# EAGLE board KickerBoard (EAGLE 9.2.0)
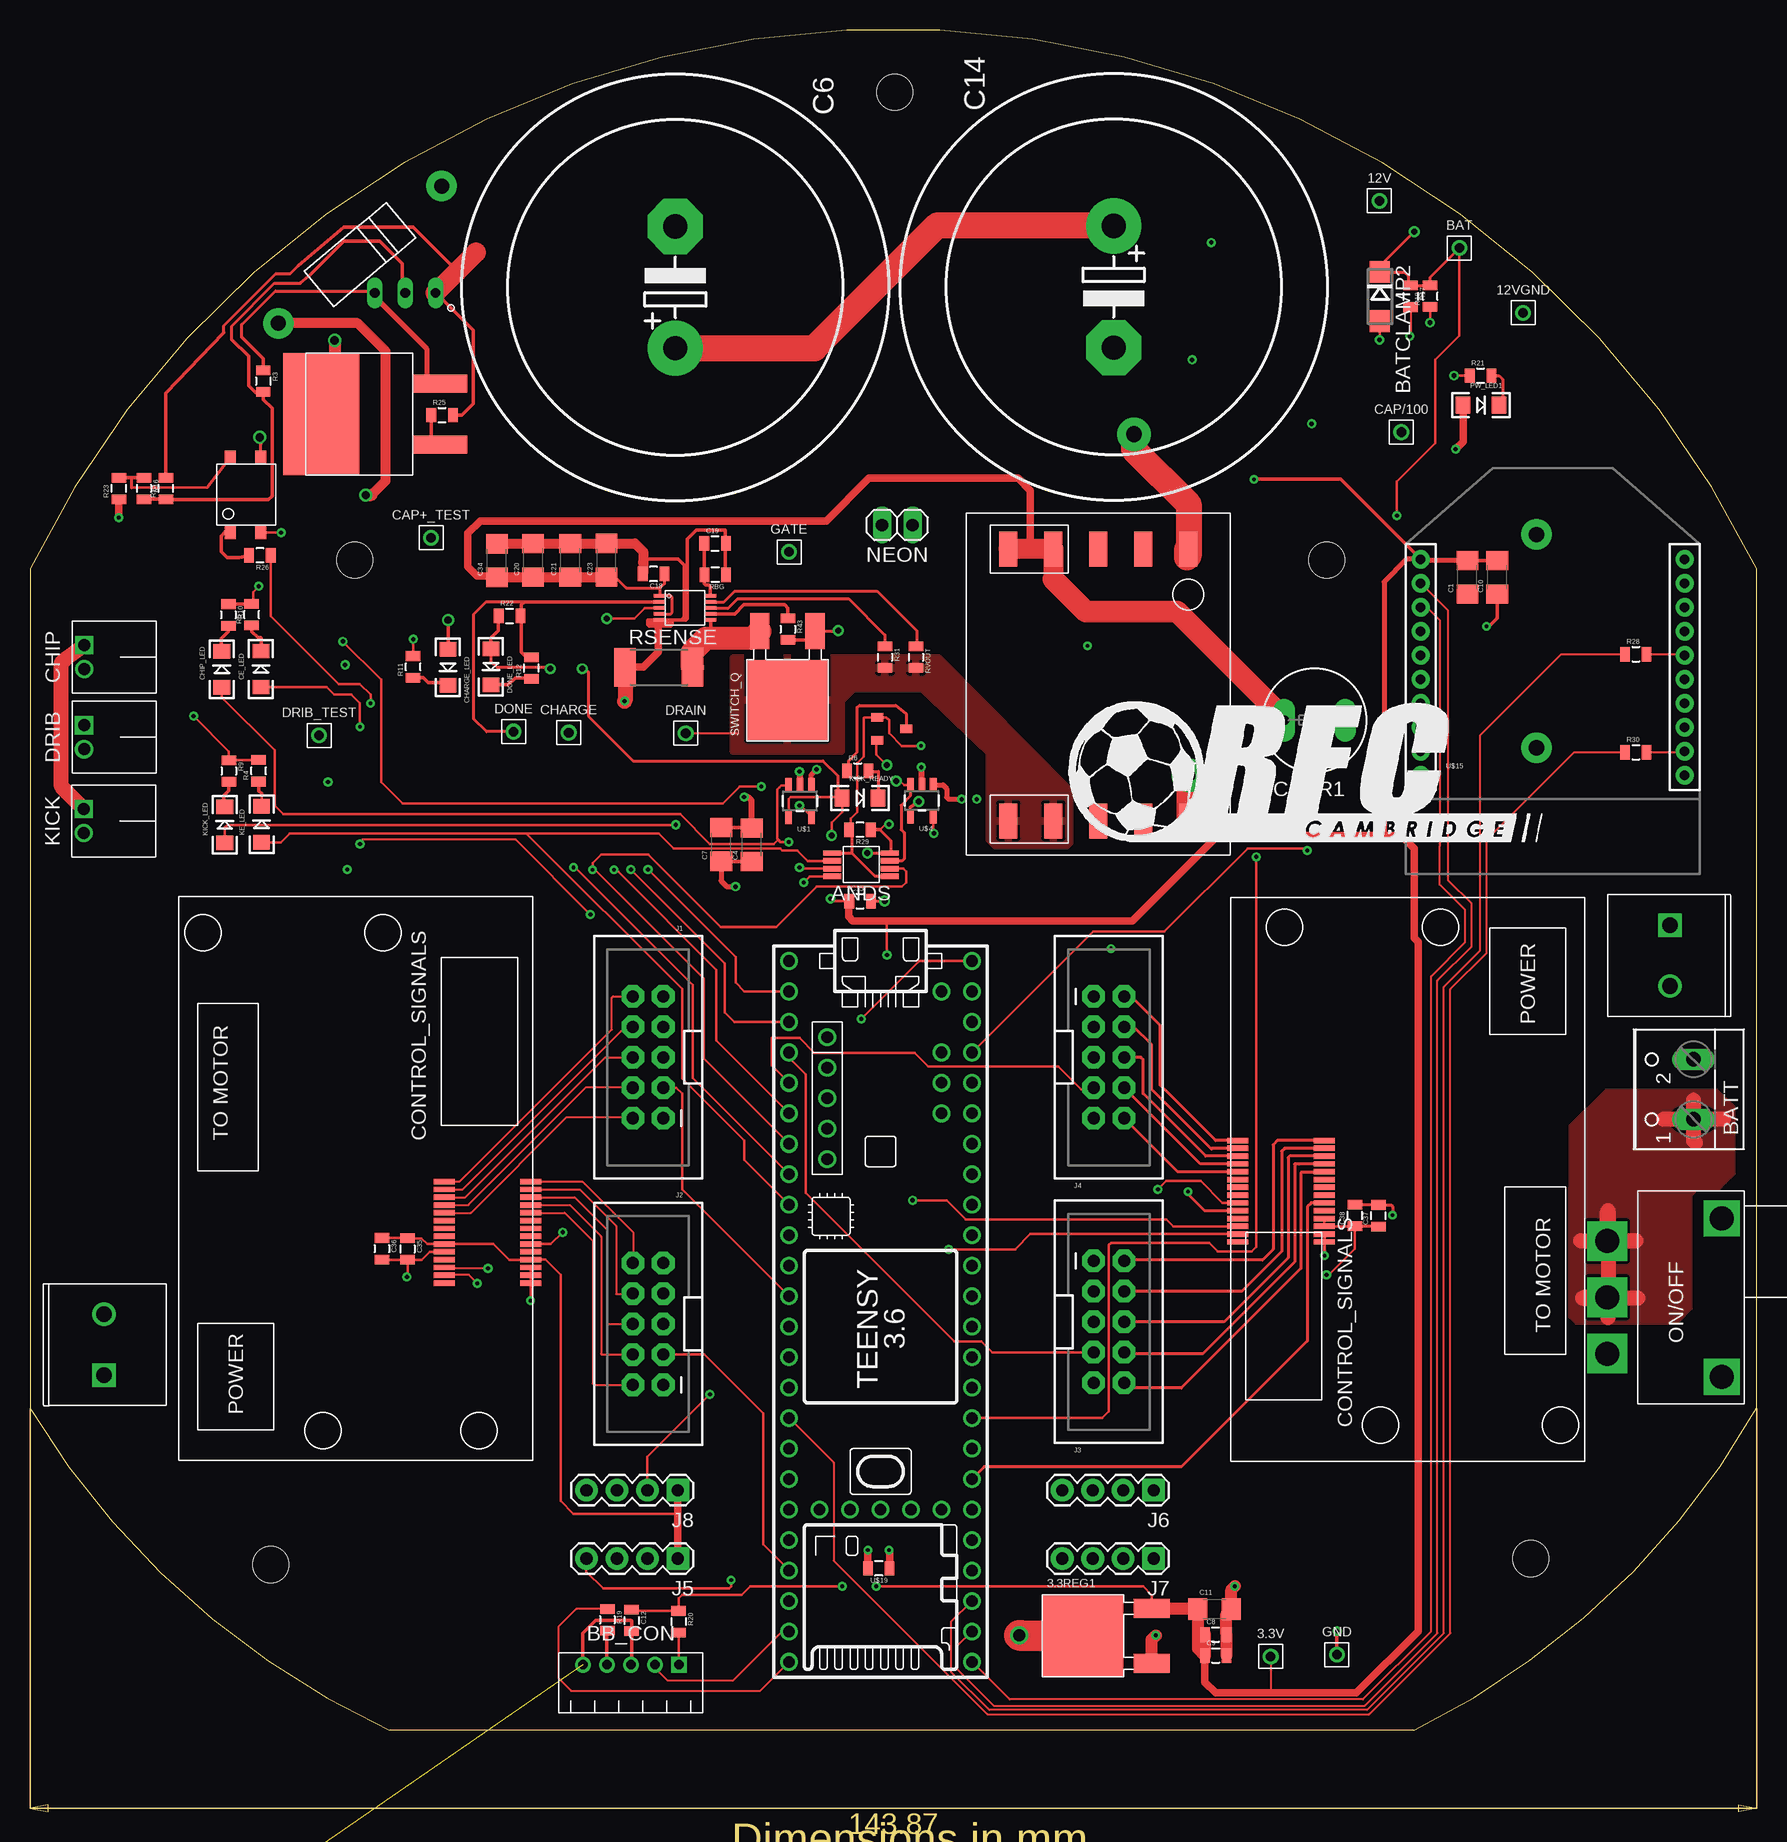
[diagram p2: board, top side]
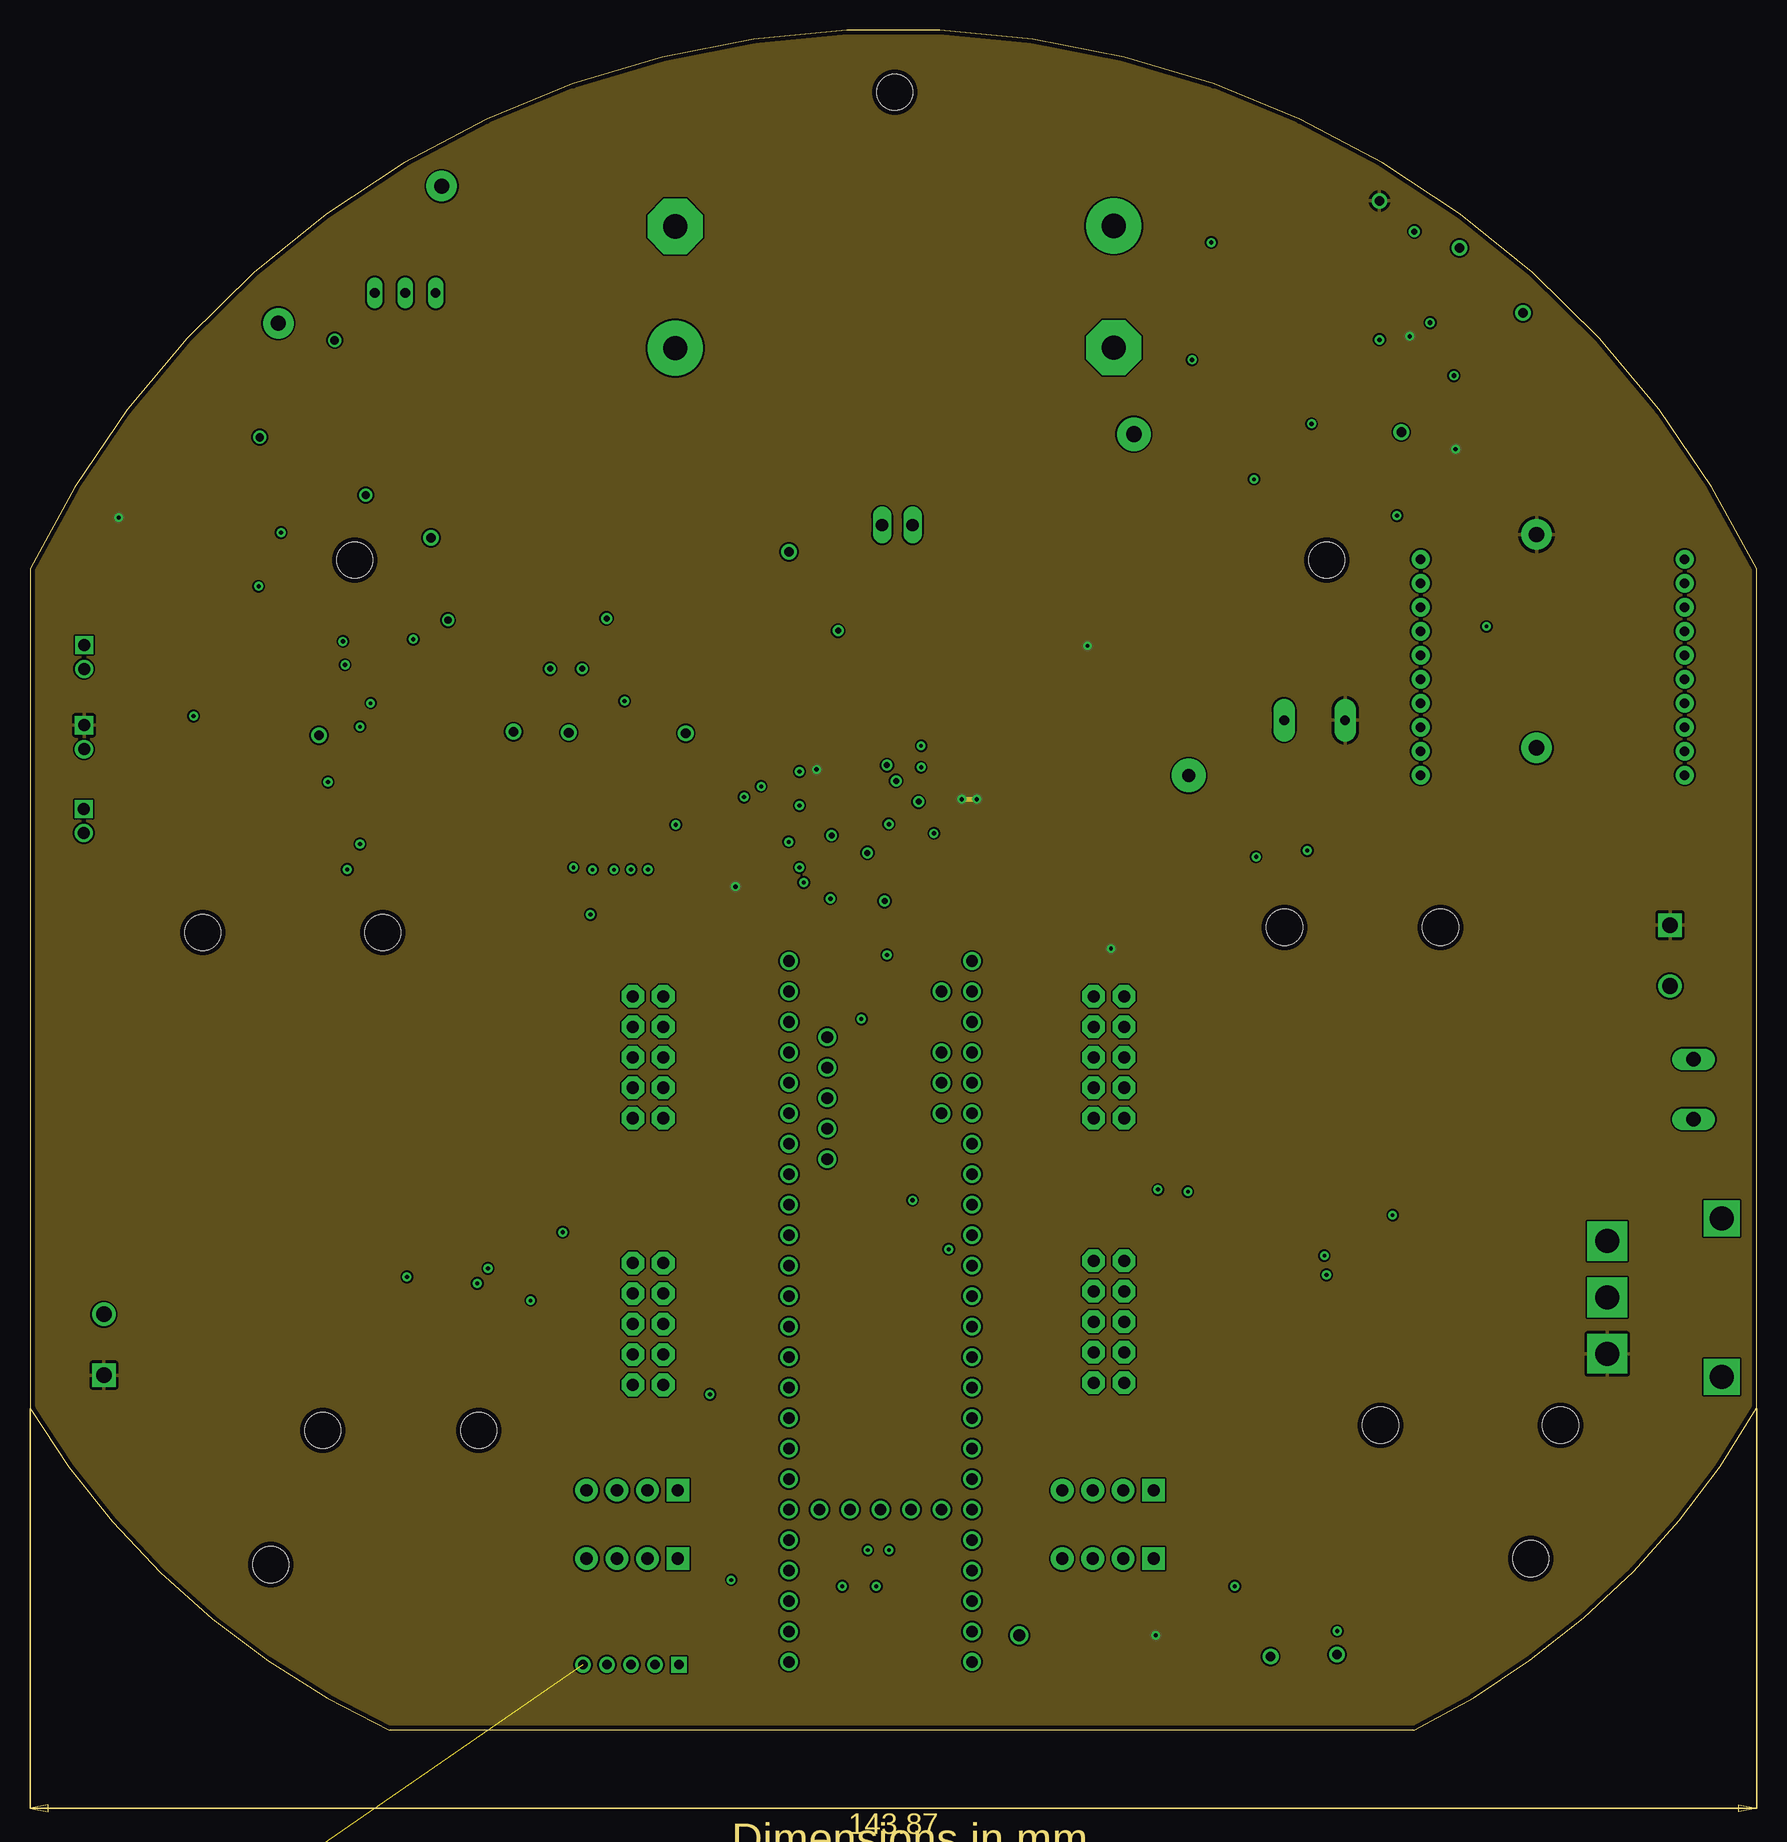
[diagram p3: board, inner layer 12V+]
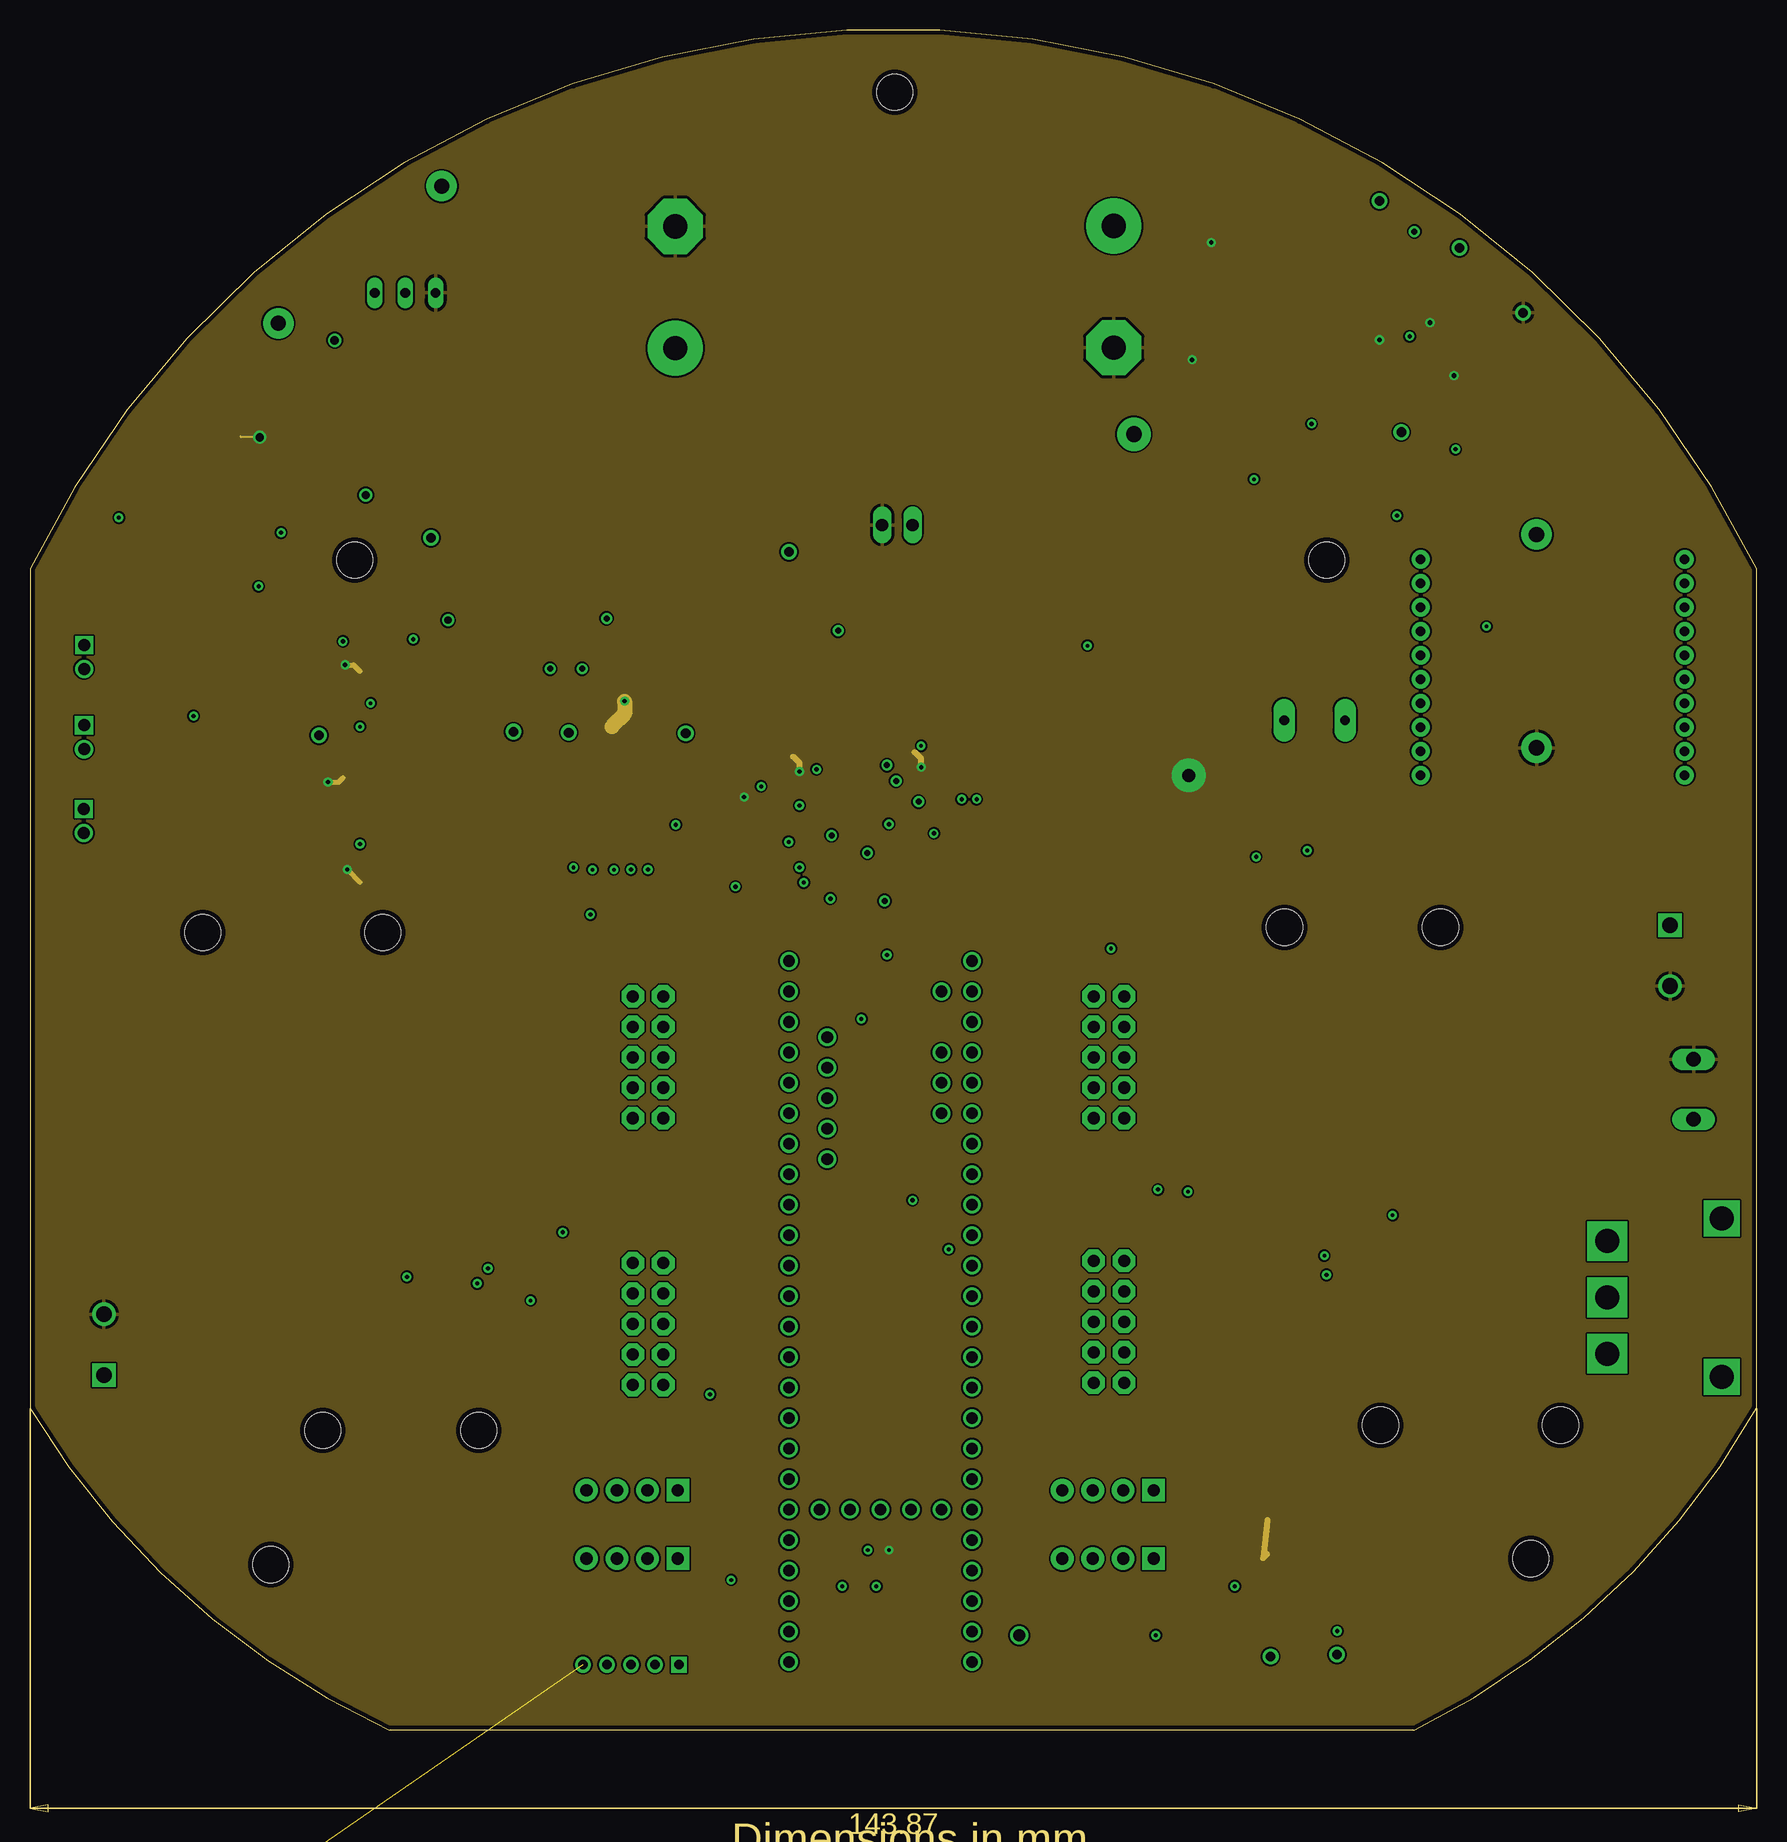
[diagram p4: board, inner layer 12VGND]
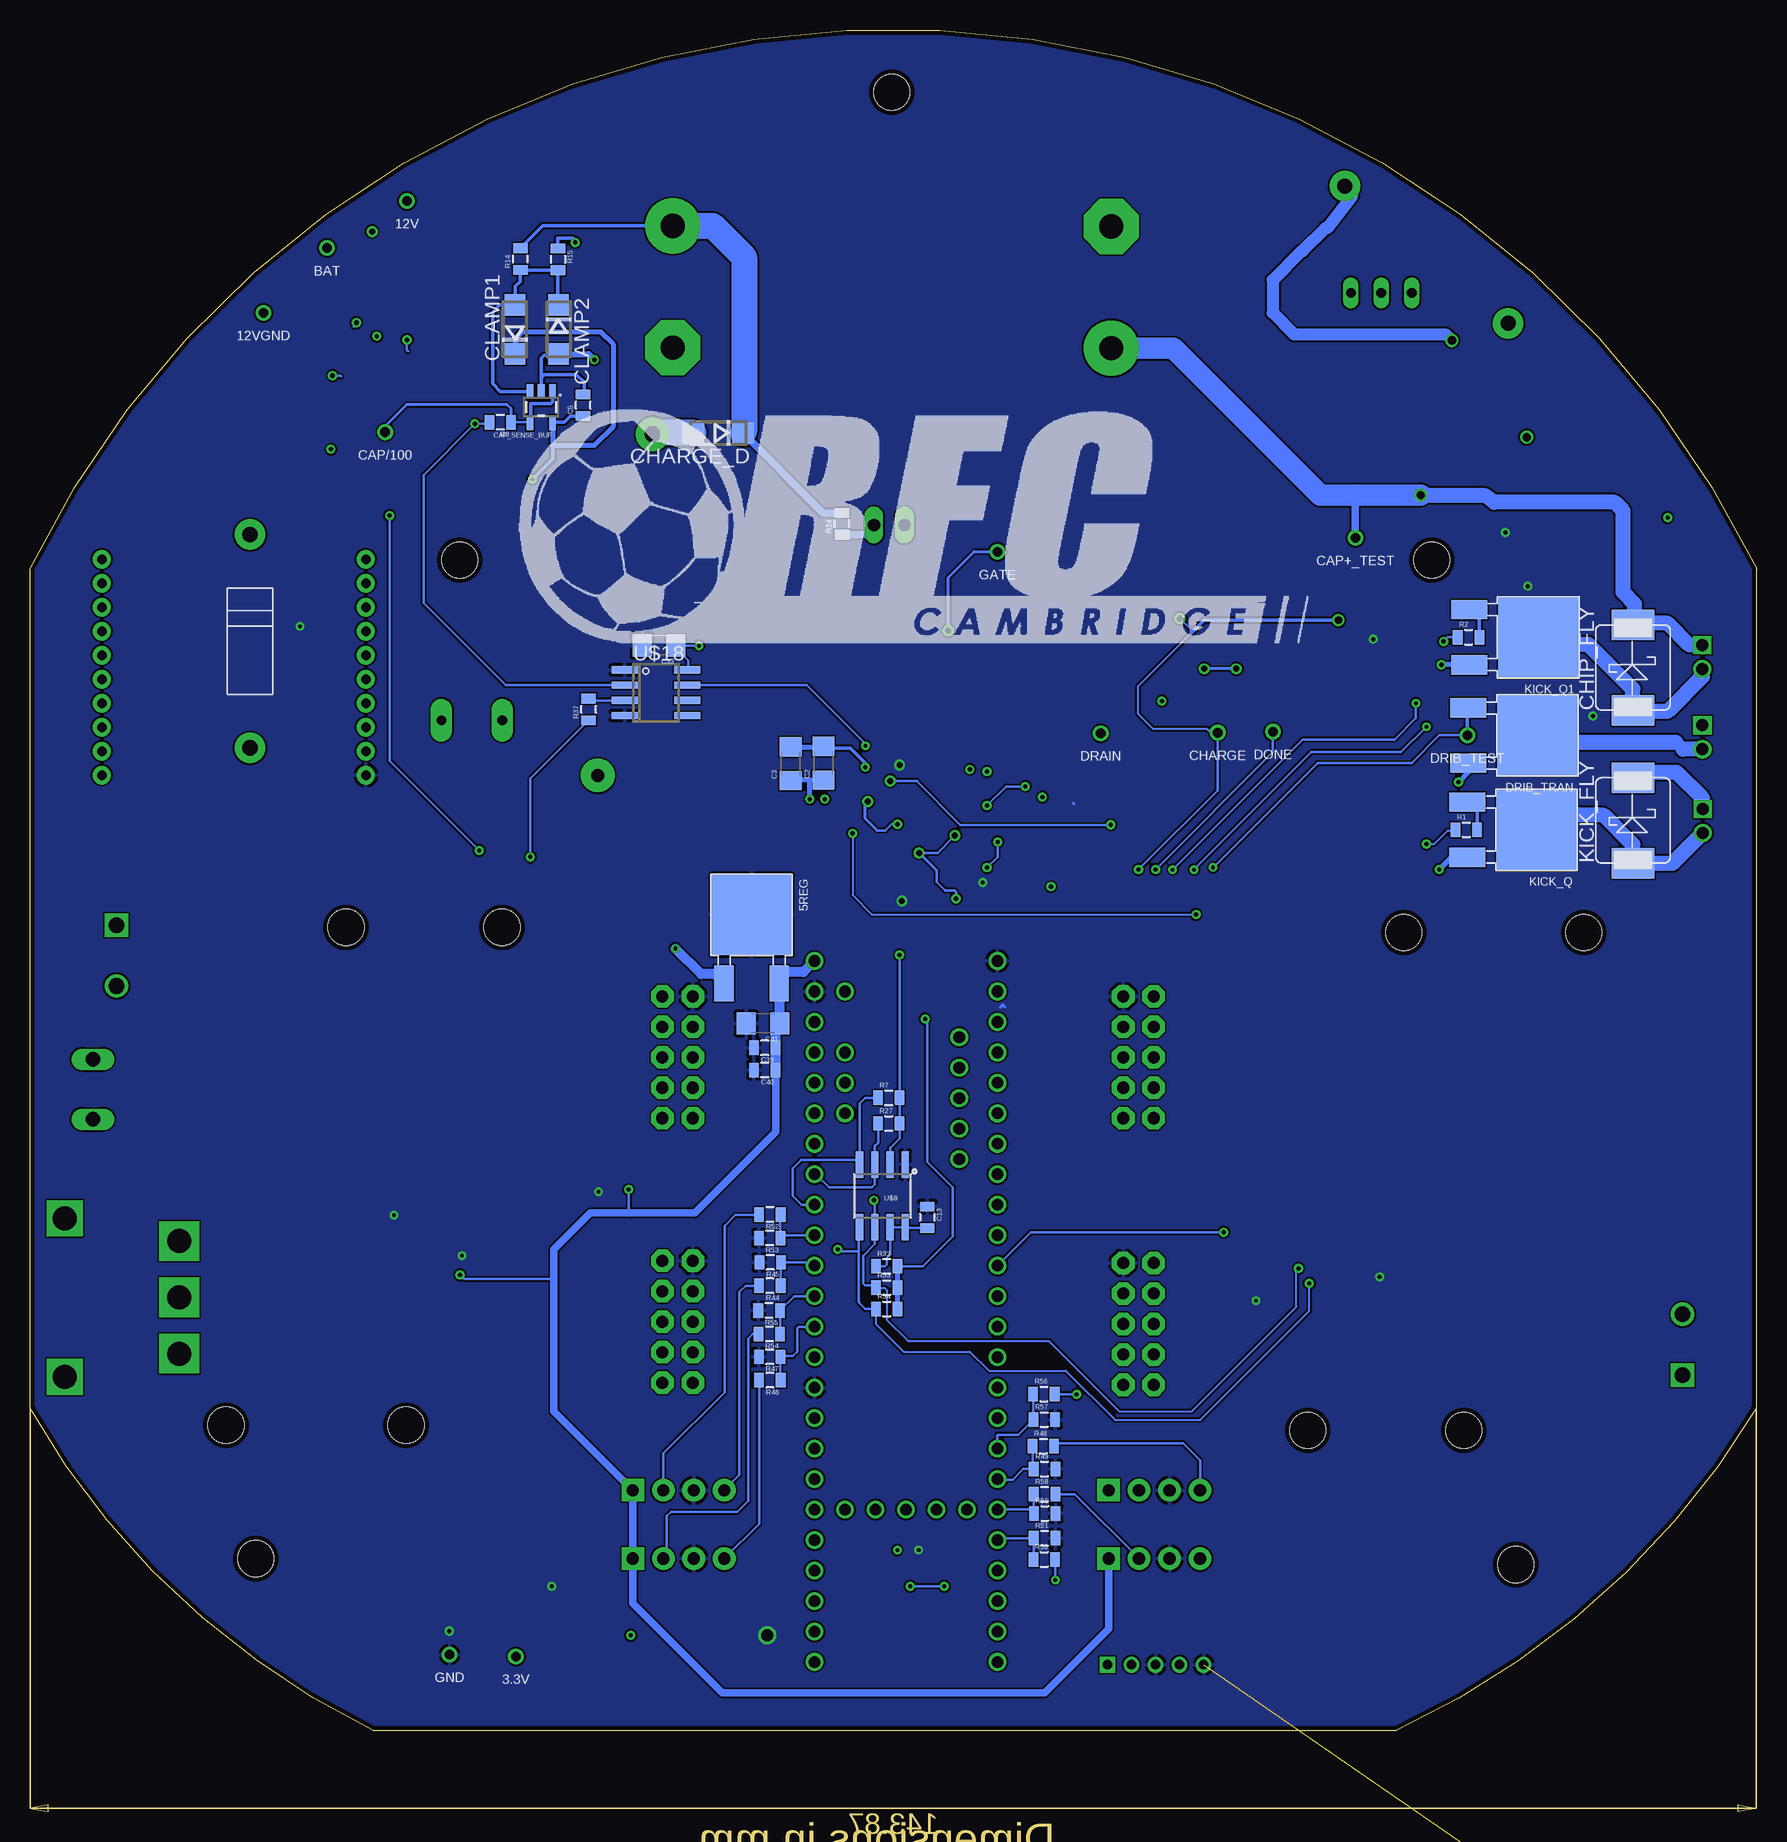
[diagram p5: board, bottom side, seen from below]

Size 143.88 x 141.72 mm. Coordinates in mm from the lower left corner, seen from the top.
Outline: 143.88,26.82 143.88,96.81 arc128 0,96.81 0,26.82 arc34 29.98,0 115.32,0 arc34 143.88,26.82
Copper layers (1*2*3*16): Top(3v3+) 0.035559375mm / dielectric 0.62mm / 12V+ 0.035559375mm / dielectric 0.62mm / 12VGND 0.035559375mm / dielectric 0.62mm / Bottom(3v3GND) 0.035559375mm
Design rules "typical_4pcb *": minimum track width 6mil, minimum drill 8mil, track to track 6mil, track to pad 6mil, pad to pad 6mil, via to via 6mil, smd to smd 6mil, copper to edge 15mil, drill to drill 8mil, minimum pad ring 10mil, minimum via ring 8mil, stop-mask expansion 4mil, vias tented up to drill 0mil, thermal gap 10mil
Holes 3 mm at 125.07,14.3 20.07,13.8 27.07,97.52 72.07,136.52 108.07,97.52

## Footprints (pad centres in the part's own frame; a part is rotated, then mirrored left to right if it is on the bottom)
DPAK = smd 6.7 x 6.7: DRAIN 0,0 | smd 3 x 1.6: GATE 5.75,-2.3; SOURCE 5.75,2.3
TESTING_PT = drill 0.8: P$1 0,0
TSSOP8 = smd 1.5 x 0.45: P$1 -2.4,0.975; P$2 -2.4,0.325; P$3 -2.4,-0.325; P$4 -2.4,-0.975; P$5 2.4,-0.975; P$6 2.4,-0.325; P$7 2.4,0.325; P$8 2.4,0.975
DO214AC = smd 1.8 x 1.7: A 2.05,0; C -2.05,0
W237-102 = drill 1.194 long: 1 -2.5,-1.27; 2 2.5,-1.27
JST-5-2MM = drill 0.8 square: 1 4,0 | drill 0.8: 2 2,0; 3 0,0; 4 -2,0; 5 -4,0
1206 = smd 1.6 x 1.8: 1 -1.4,0; 2 1.4,0
0805 = smd 0.8 x 1.2: 1 -0.9,0; 2 0.9,0
EB35D = drill 2.007 pad 4.597: + -5.08,0 | drill 2.007 pad 4.597 octagon: - 5.08,0
SOT23-5 = smd 0.55 x 1.2: 1 -0.95,-1.3; 2 0,-1.3; 3 0.95,-1.3; 4 0.95,1.3; 5 -0.95,1.3
LED-1206 = smd 1.2 x 1.4: A -1.5,0; C 1.5,0
10-MSOP = smd 0.97 x 0.31: P$1 -0.485,-0.155; P$2 -0.485,-0.655; P$3 -0.485,-1.155; P$4 -0.485,-1.655; P$5 -0.485,-2.155; P$6 3.785,-2.155; P$7 3.785,-1.655; P$8 3.785,-1.155; P$9 3.785,-0.655; P$10 3.785,-0.155
JST-2-2MM = drill 1 square: 1 1,1 | drill 1: 2 -1,1
DO214AB = smd 2.54 x 3.556: ANODE 0,3.111; CATHODE 7.112,3.111
2X5-SHROUDED = drill 1.016 pad 1.88 octagon: 1 -1.27,5.08; 2 1.27,5.08; 3 -1.27,2.54; 4 1.27,2.54; 5 -1.27,0; 6 1.27,0; 7 -1.27,-2.54; 8 1.27,-2.54; 9 -1.27,-5.08; 10 1.27,-5.08
1X04 = drill 1.016 pad 1.88 square: 1 0,0 | drill 1.016 pad 1.88: 2 2.54,0; 3 5.08,0; 4 7.62,0
TR5 = drill 0.813 pad 1.778 long: 1 -2.54,0; 2 2.54,0
1X02 = drill 1.016 long: 1 -1.27,0; 2 1.27,0
CK_SWITCH = drill 2 pad 3.302 square: COM 0,0; IN1 4.699,0; IN2 -4.699,0 | drill 2 pad 2.54 square: SUP1 -6.604,-9.525; SUP2 6.604,-9.525
R2512 = smd 1.8 x 3.2: 1 -2.8,0; 2 2.8,0
TO-263 = smd 1.524 x 4.572: LOWER_LEFT 2.54,-2.286; LOWER_RIGHT 7.62,-2.286 | smd 10.16 x 6.35: TAB 5.08,7.62
10-TRANSFORMER = smd 2.92 x 1.52: P$1 0,0; P$2 0,-3.75; P$3 0,-7.5; P$4 0,-11.25; P$5 0,-15; P$6 22.67,-15; P$7 22.67,-11.25; P$8 22.67,-7.5; P$9 22.67,-3.75; P$10 22.67,0
SOP4 = smd 0.889 x 1.143: 1 0.813,-0.584; 2 3.353,-0.584; 3 3.353,5.664; 4 0.813,5.639
TO92 = drill 0.8 long: CENTER 2.54,0; LEFT 0,0; RIGHT 5.08,0
THROUGH-HOLE-2 = drill 1.27 pad 2.54: + 0,0; - 17.78,0
SOIC8 = smd 0.61 x 2.21: 1 -1.905,-2.616; 2 -0.635,-2.616; 3 0.635,-2.616; 4 1.905,-2.616; 5 1.905,2.616; 6 0.635,2.616; 7 -0.635,2.616; 8 -1.905,2.616
MOTOR_BOARD = hole 3: 2.5,17.5; 2.5,4.5; 44,27.5; 44,12.5
1X02-PHEONIX = drill 1.3 square: 1 0,0 | drill 1.3: 2 5.08,0
TEENSY_3.5/3.6 = drill 0.965: 0/RX -25.4,-7.62; 1/TX -22.86,-7.62; 2 -20.32,-7.62; 3/CANTX -17.78,-7.62; 3V3 7.62,-7.62; 3V3_2 17.78,-2.54; 3V3_LO -22.86,7.62; 4/CANRX -15.24,-7.62; 5 -12.7,-7.62; 6 -10.16,-7.62; 7 -7.62,-7.62; 8 -5.08,-7.62; 9/CS -2.54,-7.62; 10/CS 0,-7.62; 11/MOSI 2.54,-7.62; 12/MISO 5.08,-7.62; 13/SCK 5.08,7.62; 14/A0 2.54,7.62; 15/A1 0,7.62; 16/A2 -2.54,7.62; 17/A3 -5.08,7.62; 18/A4/SDA -7.62,7.62; 19/A5/SCL -10.16,7.62; 20/A6 -12.7,7.62; 21/A7 -15.24,7.62; 21/DAC0 12.7,7.62; 22/A8 -17.78,7.62; 23/A9 -20.32,7.62; 24 10.16,-7.62; 25 12.7,-7.62; 26 15.24,-7.62; 27 17.78,-7.62; 28 20.32,-7.62; 29 22.86,-7.62; 30 25.4,-7.62; 31/A12 27.94,-7.62; 32/A13 30.48,-7.62; 33/A14 30.48,7.62; 34/A15 27.94,7.62; 35/A16 25.4,7.62; 36/A17 22.86,7.62; 37/A18 20.32,7.62; 38/A19 17.78,7.62; 39/A20 15.24,7.62; A10 -17.78,5.08; A11 -15.24,5.08; A22/DAC1 10.16,7.62; AGND -25.4,7.62; AREF -20.32,5.08; GND -27.94,-7.62; GND2 7.62,7.62; GND3 17.78,0; PROG 17.78,2.54; RESET 17.78,5.08; U5V -21.59,-4.445; UD+ -16.51,-4.445; UD- -19.05,-4.445; UGND1 -13.97,-4.445; UGND2 -11.43,-4.445; VBAT 17.78,-5.08; VIN -27.94,7.62; VUSB -25.4,5.08
XBEE-1 = drill 0.8 pad 1.524: 1 -11,20; 2 -11,18; 3 -11,16; 4 -11,14; 5 -11,12; 6 -11,10; 7 -11,8; 8 -11,6; 9 -11,4; 10 -11,2; 11 11,2; 12 11,4; 13 11,6; 14 11,8; 15 11,10; 16 11,12; 17 11,14; 18 11,16; 19 11,18; 20 11,20
MULTIPOWERSO-30 = smd 0.508 x 12: 1 -7,-4; 15 7,-4; 16 7,4; 30 -7,4 | smd 0.508 x 2: 2 -6,-9; 4 -4,-9; 5 -3,-9; 6 -2,-9; 7 -1,-9; 8 0,-9; 9 1,-9; 10 2,-9; 11 3,-9; 12 4,-9; 14 6,-9; 17 6,9; 18 5,9; 19 4,9; 20 3,9; 22 1,9; 24 -1,9; 26 -3,9; 27 -4,9; 28 -5,9; 29 -6,9 | smd 0.508 x 4: 3 -5,-8; 13 5,-8; 21 2,8; 23 0,8; 25 -2,8 | smd 6.5 x 6: OUTA -4.25,3.5; OUTB 4.25,3.5 | smd 1 x 7.5: OUTA@1 -7,-2.755; OUTB@1 7,-2.755 | smd 11 x 6: VCC 0,-3.5 | smd 0.65 x 8.3: VCC@1 0,3.145
SSOP = smd 0.45 x 1.75: 1 0,0; 2 0.65,0; 3 1.3,0; 4 1.95,0; 5 2.6,0; 6 3.25,0; 7 3.9,0; 8 4.55,0; 9 5.2,0; 10 5.85,0; 11 6.5,0; 12 7.15,0; 13 7.8,0; 14 8.45,0; 15 8.45,7.2; 16 7.8,7.2; 17 7.15,7.2; 18 6.5,7.2; 19 5.85,7.2; 20 5.2,7.2; 21 4.55,7.2; 22 3.9,7.2; 23 3.25,7.2; 24 2.6,7.2; 25 1.95,7.2; 26 1.3,7.2; 27 0.65,7.2; 28 0,7.2
SOIC8' = smd 0.6 x 2.2: 1 -1.905,-2.6; 2 -0.635,-2.6; 3 0.635,-2.6; 4 1.905,-2.6; 5 1.905,2.6; 6 0.635,2.6; 7 -0.635,2.6; 8 -1.905,2.6
SOT-23 = smd 1 x 0.7: D 0,0; G -2.4,0.95; S -2.4,-0.95
TO252-3 = smd 1 x 1.6: 1 -2.28,-6.07; 2 2.28,-6.07 | smd 5.4 x 6.2: 3 0,1.23

## Placement (x,y rotation side)
3.3REG1  3.3REG1AREG  [DPAK]  87.74,7.87 0 top
3.3V  TEST_PT  [TESTING_PT]  103.39,6.15 0 top
5REG  3.3REG1AREG  [DPAK]  83.73,67.97 270 bottom
12V  TEST_PT  [TESTING_PT]  112.46,127.47 0 top
12VGND  TEST_PT  [TESTING_PT]  124.43,118.15 0 top
ANDS  AND-DUAL  [TSSOP8]  69.25,72.14 0 top
BAT  TEST_PT  [TESTING_PT]  119.12,123.54 0 top
BATCLAMP2  DIODE-ZENERDO214AC  [DO214AC]  112.48,119.5 270 top
BATT  [W237-102]  137.36,53.42 90 top
BB_CON  JST-5  [JST-5-2MM]  50.07,5.46 0 top
C1  1uF  [1206]  119.78,96.09 90 top
C2  .1uF  [1206]  77.74,80.61 90 bottom
C3  10uF  [1206]  80.48,80.56 90 bottom
C4  .1uF  [1206]  60.15,73.81 90 top
C5  .1uF  [0805]  97.78,110.45 90 bottom
C6  1500uF  [EB35D]  53.78,120.27 90 top
C7  10uF  [1206]  57.6,73.83 90 top
C8  1uF  [0805]  98.8,7.97 0 top
C9  .01uF  [0805]  98.81,6.22 0 top
C10  .01uF  [1206]  122.27,96.09 90 top
C11  47uF  [1206]  98.71,10.11 0 top
C12  4.7uF  [0805]  50.13,9.15 270 top
C13  100nF  [0805]  69.1,42.75 270 bottom
C14  1500uF  [EB35D]  90.31,120.31 270 top
C15  .1uF  [0805]  69.17,69.1 0 top
C18  10uF  [0805]  51.96,96.38 180 top
C19  100pF  [0805]  57.09,98.92 0 top
C20  47uF  [1206]  41.93,97.51 90 top
C21  47uF  [1206]  45.02,97.52 90 top
C23  47uF  [1206]  48.04,97.52 90 top
C33  1uF  [1206]  91.47,90.41 180 bottom
C34  47uF  [1206]  38.9,97.49 90 top
C35  100nF  [0805]  31.46,40.11 270 top
C36  2.2uF  [0805]  29.33,40.14 270 top
C37  100nF  [0805]  112.36,42.88 90 top
C38  2.2uF  [0805]  110.41,42.9 90 top
C39  1uF  [0805]  82.64,56.87 180 bottom
C40  .01uF  [0805]  82.64,55.02 180 bottom
C41  47uF  [1206]  82.8,58.91 180 bottom
CAP+_TEST  TEST_PT  [TESTING_PT]  33.42,99.39 0 top
CAP/100  TEST_PT  [TESTING_PT]  114.28,108.2 0 top
CAP_SENSE_BUF  MCP6291T-E/OT  [SOT23-5]  101.27,110.28 180 bottom
CE_LED  [LED-1206]  19.24,88.45 90 top
CHARGE  TEST_PT  [TESTING_PT]  44.9,83.15 0 top
CHARGE_D  1kV, ultrafast  [DO214AC]  86.52,108.14 180 bottom
CHARGE_LED  [LED-1206]  34.83,88.6 270 top
CHARGE_U  LT3750  [10-MSOP]  52.93,94.7 0 top
CHIP  JST-22MM  [JST-2-2MM]  5.51,89.46 90 top
CHIP_FLY  DIODE-ZENERDO214AB  [DO214AB]  7.19,85.02 90 bottom
CHIP_LED  [LED-1206]  15.99,88.43 90 top
CLAMP1  DIODE-ZENERDO214AC  [DO214AC]  103.45,116.75 90 bottom
CLAMP2  DIODE-ZENERDO214AC  [DO214AC]  99.84,116.76 270 bottom
DONE  TEST_PT  [TESTING_PT]  40.3,83.23 0 top
DONE_LED  [LED-1206]  38.41,88.65 270 top
DRAIN  TEST_PT  [TESTING_PT]  54.65,83.11 0 top
DRIB  JST-22MM  [JST-2-2MM]  5.5,82.76 90 top
DRIB_TEST  TEST_PT  [TESTING_PT]  24.09,82.92 0 top
DRIB_TRAN  [DPAK]  18.26,82.92 180 bottom
GATE  TEST_PT  [TESTING_PT]  63.25,98.21 0 top
GND  TEST_PT  [TESTING_PT]  108.91,6.3 0 top
J1  [2X5-SHROUDED]  51.5,56.09 180 top
J2  [2X5-SHROUDED]  51.5,33.86 180 top
J3  [2X5-SHROUDED]  89.91,34.04 0 top
J4  [2X5-SHROUDED]  89.91,56.09 0 top
J5  [1X04]  53.99,14.3 180 top
J6  [1X04]  93.64,19.99 180 top
J7  [1X04]  93.64,14.3 180 top
J8  [1X04]  53.99,19.99 180 top
KE_LED  [LED-1206]  19.3,75.51 90 top
KICK  JST-22MM  [JST-2-2MM]  5.49,75.79 90 top
KICK_FLY  DIODE-ZENERDO214AB  [DO214AB]  7.19,72.28 90 bottom
KICK_LED  [LED-1206]  16.23,75.47 90 top
KICK_Q  [DPAK]  18.33,75.06 180 bottom
KICK_Q1  [DPAK]  18.19,91.1 180 bottom
KICK_READY  [LED-1206]  69.18,77.69 0 top
KICKER1  [TR5]  107.05,84.19 180 top
NEON  [1X02]  72.28,100.46 180 top
ON/OFF  SPDT-SWITCH  [CK_SWITCH]  131.44,36.07 90 top
PW_LED1  [LED-1206]  120.91,110.45 0 top
R1  100  [0805]  24.18,75.05 0 bottom
R2  100  [0805]  24,91.11 0 bottom
R3  250k  [0805]  19.44,112.45 270 top
R4  1k  [0805]  19.05,79.97 90 top
R5  1k  [0805]  18.47,93 90 top
R6  1k  [0805]  68.99,79.98 0 top
R7  4.7k  [0805]  72.3,52.71 0 bottom
R8  1k  [0805]  104.69,109.02 180 bottom
R9  1k  [0805]  16.58,79.94 270 top
R10  1k  [0805]  16.53,92.97 270 top
R11  1k  [0805]  31.92,88.63 90 top
R12  1k  [0805]  41.79,88.54 90 top
R13  2.5k  [0805]  11.33,103.5 90 top
R14  1M  [0805]  103.01,122.64 90 bottom
R15  10K  [0805]  99.88,122.6 270 bottom
R16  1k  [0805]  9.5,103.5 270 top
R17  80k  [0805]  115.05,119.52 270 top
R18  20k  [0805]  116.68,119.54 90 top
R19  20  [0805]  48.11,9.21 270 top
R20  100  [0805]  54.05,9.05 270 top
R21  1k  [0805]  120.88,112.9 0 top
R22  100k  [0805]  39.97,92.88 0 top
R23  1.5k  [0805]  7.4,103.5 90 top
R24  536k  [0805]  76.22,100.56 90 bottom
R25  200  [0805]  34.34,109.61 0 top
R26  300  [0805]  19.16,97.93 180 top
R27  4.7k  [0805]  72.3,50.58 0 bottom
R28  0  [0805]  133.82,89.69 0 top
R29  1M  [0805]  69.16,75.05 180 top
R30  0  [0805]  133.82,81.51 0 top
R31  43k  [0805]  71.25,89.44 270 top
R32  200k  [0805]  72.48,38.66 0 bottom
R33  4.7k  [0805]  72.48,36.88 0 bottom
R34  4.7k  [0805]  72.48,35.11 0 bottom
R35  1K  [0805]  -29.57,-104.29 0 top  (outside the outline)
R36  1K  [0805]  -32.6,-104.29 0 top  (outside the outline)
R37  100k  [0805]  97.32,85.09 90 bottom
R43  100  [0805]  63.16,91.77 270 top
R44  39k  [0805]  82.21,37.04 180 bottom
R45  75k  [0805]  82.19,38.99 180 bottom
R46  39k  [0805]  82.21,29.16 180 bottom
R47  75k  [0805]  82.24,31.12 180 bottom
R48  39k  [0805]  59.43,23.68 0 bottom
R49  75k  [0805]  59.33,21.77 0 bottom
R50  39k  [0805]  59.35,14.23 0 bottom
R51  75k  [0805]  59.33,16.01 0 bottom
R52  39k  [0805]  82.21,42.98 180 bottom
R53  75k  [0805]  82.24,41.02 180 bottom
R54  39k  [0805]  82.26,33.02 180 bottom
R55  75k  [0805]  82.29,34.98 180 bottom
R56  39k  [0805]  59.38,28.02 0 bottom
R57  75k  [0805]  59.35,25.89 0 bottom
R58  39k  [0805]  59.33,19.66 0 bottom
R59  75k  [0805]  59.3,18.06 0 bottom
RBG  2.49k  [0805]  57.1,96.31 180 top
RSENSE  10m  [R2512]  52.39,88.59 0 top
RVOUT  50.4k  [0805]  73.83,89.44 270 top
SWITCH_Q  [DPAK]  63.12,85.86 90 top
U$1  FAN31111  [SOT23-5]  64.17,77.45 180 top
U$2  IXTA3N50D2  [TO-263]  31.88,104.62 90 top
U$3  32052-TRANSFORMER  [10-TRANSFORMER]  96.53,98.46 270 top
U$4  FAN31111  [SOT23-5]  74.32,77.49 180 top
U$5  VO1400AEFTR  [SOP4]  15.88,100.44 0 top
U$6  ZTX718  [TO92]  33.81,119.81 180 top
U$7  1N4007  [THROUGH-HOLE-2]  20.69,117.28 40 top
U$8  PCA9306  [SOIC8]  72.84,44.53 180 bottom
U$9  MOTOR_BOARD  [MOTOR_BOARD]  41.9,22.48 90 top
U$10  MOTOR_BOARD  [MOTOR_BOARD]  100.04,69.42 270 top
U$11  PHEONIX-SCREW-TERM  [1X02-PHEONIX]  136.67,67.11 270 top
U$12  13VZENER  [THROUGH-HOLE-2]  125.55,81.88 90 bottom
U$13  PHEONIX-SCREW-TERM  [1X02-PHEONIX]  6.16,29.59 90 top
U$14  TEENSY_3.5/3.6  [TEENSY_3.5/3.6]  70.88,36.17 270 top
U$15  XBEE-1B1  [XBEE-1]  126.89,77.6 0 top
U$16  VNH5019  [MULTIPOWERSO-30]  -5.93,-35.3 0 top  (outside the outline)
U$17  IO-EXPANDER  [SSOP]  34.54,45.72 270 top
U$18  LM311  [SOIC8']  91.71,86.48 270 bottom
U$19  INDUCTOR  [0805]  70.73,13.49 180 top
U$20  VNH5019  [MULTIPOWERSO-30]  -5.93,-55.57 0 top  (outside the outline)
U$21  IO-EXPANDER  [SSOP]  100.65,49.15 270 top
U$22  N-FET  [SOT-23]  73.02,83.47 0 top
U$23  VNH5019  [MULTIPOWERSO-30]  -5.93,-75.84 0 top  (outside the outline)
U$24  VNH5019  [MULTIPOWERSO-30]  -5.93,-96.11 0 top  (outside the outline)
U$25  MOSFET-NCH  [TO252-3]  -22.46,-98.78 0 top  (outside the outline)

## Tracks (layer width: path | path; a pad name or v marks a point on that pad's centre or on a via)
3.3V  (via drill 0.3, 0.35, 0.38, 0.5)
  Top(3v3+) 0.152: 3.3V.P$1 103.39,3.13 103.42,3.1
  Top(3v3+) 0.203: U$1.4 63.22,76.89 | 63.22,76.89 63.22,76.97 | C12.1 50.23,9.95 R20.1 54.05,10.99 54.35,11.28 59.33,11.28 60.04,11.99 v67.68,11.99 | C15.1 68.22,69.1 66.91,69.1 v66.69,69.32 | 70.12,75.11 70.91,75.11 71.31,75.52 v71.57,75.52 | 67.33,77.69 KICK_READY.A | KICK_READY.A 67.68,76.53 66.79,75.64 v66.79,74.58 | 63.22,76.89 63.24,76.91 63.24,77.6 63.41,77.78 67.59,77.78 KICK_READY.A | v71.42,64.62 71.42,67.47 | v70.53,11.99 92.75,11.99 93.49,11.26 3.3REG1.SOURCE
  Top(3v3+) 0.254: v69.79,73.13 71.64,73.13 ANDS.P$8 71.72,73.19 71.72,74.15 70.81,75.05 R29.1 70.12,75.11 | U$4.4 73.37,76.97 v74.06,77.4 | DONE_LED.A 38.41,89.09 38.9,88.6 43.22,88.6 v43.35,88.47 | v46.02,88.47 46.27,88.47 46.52,88.22 46.52,84.53 50.26,80.8 66.08,80.8 67.33,79.56 67.33,77.69
  Top(3v3+) 0.305: DONE_LED.A 38.41,91.03 39.03,91.65 39.03,92.85 R22.1 | v102,104.27 109.22,104.27 U$15.1 | C1.2 C10.2
  Top(3v3+) 0.406: C1.2 116,97.49 U$15.1 114.71,97.6 112.84,95.74 112.84,74.58
  Top(3v3+) 0.61: C9.1 97.91,4 98.8,3.1 103.42,3.1 110.53,3.1 115.69,8.26 115.69,65.68 115.36,66.02 115.36,73.49 114.27,74.58 112.84,74.58 98.97,74.58 91.86,67.47 71.42,67.47 68.57,67.47 68.22,67.82 68.22,69.1
  Top(3v3+) 1.016: 3.3REG1.SOURCE 97.26,10.17 C11.1 97.31,6.82 C9.1 97.9,6.23 C8.1
  Bottom(3v3GND) 0.2: R27.2 R7.2
  Bottom(3v3GND) 0.203: v66.69,69.32 66.69,69.88 66.79,69.98 67.61,69.98 68.32,70.69 68.32,71.66 | v71.57,75.52 72.08,75.52 72.58,75.01 73.3,75.01 73.35,75.06 | v66.79,74.58 68.24,73.13 v69.79,73.13 | R7.2 71.41,64.61 v71.42,64.62 | R27.2 71.41,49.34 72.2,48.54 U$8.2 | v67.68,11.99 v70.53,11.99
  Bottom(3v3GND) 0.254: 68.32,71.66 v69.79,73.13 | v74.06,77.4 74.31,77.14 74.31,76.03 73.35,75.06 | v43.35,88.47 v46.02,88.47
  Bottom(3v3GND) 0.305: C5.1 98.85,109.55 99.36,109.05 100.25,109.05 CAP_SENSE_BUF.5 | 100.32,107.12 100.32,105.95 v102,104.27
  Bottom(3v3GND) 0.406: CAP_SENSE_BUF.5 100.32,107.12 96.84,107.12 95.24,108.72 95.24,115.47 96.31,116.54 102.89,116.54 103.45,115.97 CLAMP1.C
5V  (via drill 0.35)
  Top(3v3+) 0.203: C36.1 31.44,41.04 C35.1 32.62,41.01 33.11,40.52 U$17.9 38.62,40.52 39.95,39.2 41.71,39.2 U$17.18 42.94,39.22 44.21,37.95 44.21,19.11 45.28,18.04 53.99,18.04 | v69.28,59.29 74.11,64.11 U$14.VIN | U$21.9 99.37,43.95 97.55,45.77 94.71,45.77 v94,45.06 | U$21.18 U$21.17 C38.1 110.41,40.14 108.22,37.95 v108.04,37.95
  Top(3v3+) 0.254: C37.1 110.43,41.98 C38.1 | U$21.17
  Top(3v3+) 0.61: J5.1 53.99,18.04 J8.1
  Bottom(3v3GND) 0.203: R32.2 69.46,38.66 66.97,41.15 66.97,45.24 69.11,47.38 69.11,59.29 v69.28,59.29 | v94,45.06 94,43.29 93.82,43.11 | v108.04,37.95 107.69,37.6 100.22,37.6
  Bottom(3v3GND) 0.406: R34.2 R33.2 R32.2
  Bottom(3v3GND) 0.61: C40.1 81.74,49.85 88.48,43.11 93.82,43.11 97.2,43.11 100.22,40.09 100.22,37.6 100.22,26.57 J6.1 J7.1 93.64,10.57 86.17,3.1 59.33,3.1 53.99,8.44 J5.1
  Bottom(3v3GND) 0.813: C40.1 C39.1 81.74,58.56 C41.1 81.39,62.18 | 81.39,62.18 5REG.SOURCE | U$14.VIN 79.42,63.2 81.37,63.2 81.39,63.18 81.39,62.18
12V  (via drill 0.3, 0.35)
  Top(3v3+) 0.152: R17.2 115.05,116.25 v114.98,116.18
  Top(3v3+) 0.305: C4.1 57.63,72.41 C7.1
  Top(3v3+) 0.406: C7.1 57.6,70.79 58.08,70.31 v58.79,70.31 | U$4.1 76.1,78.78 76.39,78.49 76.39,77.78 76.57,77.6 v77.64,77.6 | U$1.1 65.12,79.66 v65.55,80.09
  Top(3v3+) 0.61: v118.8,106.77 119.42,107.39 119.42,110.44 PW_LED1.A | R23.1 7.4,101.79 7.41,101.78 v7.41,101.07
  Top(3v3+) 1.016: 3.3REG1.GATE 93.49,7.52 93.46,7.55 v93.82,7.9
  12V+ 0.406: v77.64,77.6 v78.88,77.6
  Bottom(3v3GND) 0.203: U$18.8 89.02,88.47 89.02,89.16 90.07,90.2 C33.1 v88.14,90.41 v88.13,90.4
  Bottom(3v3GND) 0.406: C2.1 78.88,79.21 | 78.88,79.21 80.44,79.21 C3.1 | v78.88,77.6 78.88,79.21
  Bottom(3v3GND) 0.813: 5REG.GATE 86.83,63.02 87.95,63.02 v90.08,65.16
  pour 12V+: -11.79,135.56 -11.79,15.55 17.19,-13.43 132.4,-13.43 151.96,6.13 151.96,125.96 131.51,146.41 -0.95,146.41
12V-KICKER
  Top(3v3+) 0.254: C18.1 52.86,95.57 52.49,95.2 52.49,95.08 | 52.49,95.08 52.49,94.6 CHARGE_U.P$1 52.46,94.57 53.38,94.57 53.51,94.44 53.51,93.17 53.39,93.05 CHARGE_U.P$4 | 48.03,96.11 48.79,96.11 49.7,95.2 52.37,95.2 52.49,95.08 | 48.02,96.12 C23.1
  Top(3v3+) 0.61: 82.97,98.46 83.35,98.84 83.35,103.33 82.34,104.35 69.89,104.35 66.34,100.79 37.51,100.79 36.49,99.78 36.49,96.98 37.25,96.22 40.68,96.22 40.65,96.19 40.65,96.12
  Top(3v3+) 0.813: C20.1 C21.1 48.03,96.11 C23.1 | 40.65,96.12 48.02,96.12 48.05,96.09 C34.1
  Top(3v3+) 1.676: 85.26,95.97 85.26,98.44 U$3.P$4 82.97,98.46 U$3.P$5
  Top(3v3+) 1.78: 85.26,95.97 87.98,93.25 95.6,93.25 104.51,84.33 KICKER1.2
12VGND  (via drill 0.3, 0.35, 0.38, 0.7, 1.1 pad 2.79)
  Top(3v3+) 0.203: 64.15,78.73 U$1.2 | R21.1 v118.66,112.9 v118.66,112.91 | R18.1 v116.68,117.33 | BATCLAMP2.A 112.48,115.92 v112.46,115.9
  Top(3v3+) 0.254: U$5.3 19.23,107.23 v19.14,107.78 | 16.13,116.5 16.13,117.06 20.49,121.42 21.68,121.42 22.33,122.07 | 74.32,79.24 U$4.2
  Top(3v3+) 0.305: R25.2 35.98,109.61 36.92,110.56 36.92,116.7 U$6.LEFT | R13.2 11.33,111.46 16.13,116.5 | 22.33,122.07 26.16,125.26 31.93,125.26 35.59,121.6 | C7.2 60.12,75.23 C4.2 | 52.37,92.16 51.48,92.16 51.6,92.03 53.38,92.03 53.51,92.16 53.51,92.41 53.38,92.28 51.48,92.28 51.48,92.54 53.51,92.54 53.5,92.55 CHARGE_U.P$5 54.28,92.55 54.52,92.79 | 54.52,92.79 54.52,97.11 54.02,97.62 51.35,97.62 51.1,97.36 | 54.52,92.79 54.52,92.66 54.4,92.54 54.65,92.54 54.78,92.66 54.78,99.27 55.54,100.03 57.95,100.03 57.95,98.95 C19.2 57.95,98.88 57.95,96.36 RBG.1
  Top(3v3+) 0.508: U$4.2 74.32,80.21 v74.26,80.27 | U$1.2 64.17,80.05 v64.13,79.91 | C4.2 60.14,77.49 59.86,77.78 v59.5,77.78
  Top(3v3+) 0.61: 52.37,92.16 52.37,89.87 51.1,88.6 RSENSE.1 | U$19.1 71.63,14.8 71.59,14.84 v71.59,15.02
  Top(3v3+) 0.813: C18.2 51.1,96.41 51.1,97.36 51.1,98.25 50.42,98.92 C23.2 48.03,98.92 C21.2 C20.2 41.91,98.89 C34.2
  Top(3v3+) 1.27: RSENSE.1 49.59,85.83 v49.55,85.78
  Top(3v3+) 1.676: 37.18,123.19 35.59,121.6 U$6.LEFT
  Top(3v3+) 1.93: U$3.P$10 96.53,79.55 v96.56,79.58
  12VGND 0.152: v19.14,107.78 17.59,107.78 17.54,107.83
  12VGND 0.406: v26.26,88.8 26.97,88.8 27.5,88.27 | v24.83,79.02 25.72,79.02 26.08,79.38 | v26.43,71.73 27.5,70.67
  12VGND 0.508: 103.11,17.5 102.76,14.36 103.06,14.66 | v74.26,80.27 74.26,80.98 73.73,81.51 | v64.13,79.91 64.13,80.62 63.59,81.16
  12VGND 1.27: v49.55,85.78 49.55,84.71 48.48,83.65
  Bottom(3v3GND) 0.152: C5.2 97.7,111.43 | CLAMP2.A 100.14,114.71 100.22,114.63
  Bottom(3v3GND) 0.203: v118.66,112.91 118,112.91 117.95,112.86 | v116.68,117.33 116.68,117.17 116.88,116.97 | v112.46,115.9 112.46,115.04 112.36,114.94
  Bottom(3v3GND) 0.305: 99.92,114.63 100.22,114.63 101.01,114.63 101.27,114.37 CAP_SENSE_BUF.2 101.27,112.72 101.01,112.98 98.34,112.98 97.7,112.35 97.7,111.43 | R15.1 99.88,124.35 99.69,124.36 98.62,124.36 v98.44,124.01 | v74.26,80.27 74.26,80.62 75.5,81.87 77.69,81.87 77.78,81.97
  Bottom(3v3GND) 0.406: 81.02,81.43 C3.2 77.78,81.97 C2.2 | KICK_Q1.SOURCE v26.25,88.8 v26.26,88.8 | DRIB_TRAN.SOURCE 24.01,79.85 v24.83,79.02 | KICK_Q.SOURCE 25.4,72.76 v26.43,71.73
  Bottom(3v3GND) 0.508: CLAMP2.A 97.32,114.71 v96.84,114.23
  pour 12VGND: -16.59,149.25 167.07,149.25 167.07,-24.28 167.78,-24.99 -16.59,-24.99
BAT+
  Top(3v3+) 1.27: ON/OFF.IN1 133.8,40.77 133.82,40.8 131.42,40.8 | 129.2,40.8 131.42,40.8 | 131.42,40.8 ON/OFF.IN1 | ON/OFF.IN1 131.44,43.22 131.51,43.29 131.51,36 | 131.51,34.4 131.51,36 | ON/OFF.COM 129.46,36.07 129.38,36 131.52,36 | 134,36 131.52,36 | 131.52,36 131.51,36 | BATT.1 138.63,52.52 138.62,52.53 138.62,49.15 138.63,49.15 | 138.8,48.98 138.63,49.15 | 138.63,49.15 BATT.1 | 136.14,50.93 138.62,50.93 BATT.1 | 141.11,50.93 141.1,50.92 BATT.1
  pour Top(3v3+): 138.62,53.42 140.58,53.42 142,52 142,49.15 142,46.31 141.29,45.6 140.76,45.06 138.98,45.06 138.45,44.53 138.45,40.62 138.45,35.11 137.38,34.04 137.2,33.86 128.85,33.86 128.31,34.4 128.31,50.4 131.33,53.42
BATSENSE  (via drill 0.35, 0.5)
  Top(3v3+) 0.203: U$14.23/A9 88.59,66.58 94.53,66.58 101.46,73.51 106.44,73.51 v106.44,73.33 | v113.91,101.25 113.91,104.09 117.11,107.29 117.11,114.23 119.12,116.24 BAT.P$1
  Top(3v3+) 0.254: BAT.P$1 116.68,121.1 R18.2 116.66,120.42 R17.1 114.85,120.62 114.85,121.24 114.54,121.55 BATCLAMP2.C | 112.48,122.04 v115.36,124.92
  Top(3v3+) 0.406: BATCLAMP2.C 112.48,122.04
  Bottom(3v3GND) 0.203: v106.44,73.33 113.91,80.8 v113.91,101.25
  Bottom(3v3GND) 0.406: v115.36,124.92 115.1,124.92
BB_IN
  Top(3v3+) 0.152: BB_CON.2 52.07,5.2 53.1,4.17 58.61,4.17 62.68,8.23 U$14.31/A12
BB_OUT
  Top(3v3+) 0.152: R19.1 45.53,10.11 44.03,8.61 44.03,4.35 45.1,3.28 60.85,3.28 U$14.32/A13
BREN0
  Top(3v3+) 0.152: U$17.3 36.28,44.42 47.95,56.09 J1.6
BREN1
  Top(3v3+) 0.254: U$21.26 104.97,47.85 104.84,47.73 104.84,39.37 99.51,34.04 J3.6
BREN2
  Top(3v3+) 0.254: U$21.3 97.96,47.85 92.75,53.06 92.75,55.91 92.57,56.09 J4.6
BREN3
  Top(3v3+) 0.152: U$17.26 45.39,44.42 48.12,41.69 48.12,33.86 J2.6
CAP+  (via drill 0.7)
  Top(3v3+) 0.813: 28.44,102.95 29.63,104.14 29.63,114.94 27.29,117.28 U$7.+
  Top(3v3+) 1.016: v27.98,102.95 28.44,102.95 | KICK.1 4.49,76.96
  Top(3v3+) 1.27: CHIP.1 2.94,89.3 2.61,88.97 2.61,78.67 KICK.1
  Top(3v3+) 2.184: C6.+ 65.36,115.19 75.61,125.43 90.27,125.43 C14.+
  Bottom(3v3GND) 0.203: 4.49,76.96 KICK.1
  Bottom(3v3GND) 0.305: C14.+ 101.16,125.39 R14.2
  Bottom(3v3GND) 0.61: R24.2 77.79,101.46 CHARGE_D.C | CAP+_TEST.P$1 33.42,102.93 33.44,102.95
  Bottom(3v3GND) 0.813: 9.85,79.84 KICK_FLY.CATHODE | 10.15,92.28 CHIP_FLY.CATHODE
  Bottom(3v3GND) 1.016: 27.93,102.9 v27.98,102.95
  Bottom(3v3GND) 1.27: 9.85,79.84 6.65,79.84 4.49,77.68 4.49,76.96 | CHIP.1 5.59,90.46 7.41,92.28 10.15,92.28 10.15,93.88 11.12,94.85 11.12,101.66 11.83,102.37 21.86,102.37 22.6,102.9 27.93,102.9
  Bottom(3v3GND) 1.778: C6.+ 48.6,115.19 36.36,102.95 33.44,102.95 v27.98,102.95 | 90.27,125.43 C14.+
  Bottom(3v3GND) 2.184: C14.+ 87,125.39 84.37,122.76 84.37,108.24 CHARGE_D.C
CHARGE  (via drill 0.35, 0.5, 0.6)
  Top(3v3+) 0.203: v48.05,92.66 50.33,92.66 51.22,93.55 CHARGE_U.P$3 | U$14.0/RX 59.53,61.57 58.79,62.31 58.79,64.44 v51.5,71.73
  Top(3v3+) 0.305: CHARGE_LED.A v34.84,92.54
  Bottom(3v3GND) 0.178: CHARGE.P$1 45.5,83.15 45.81,83.47 50.26,83.47 51.5,84.71 51.5,87.05 46.54,92.02
  Bottom(3v3GND) 0.203: 47.16,91.39 47.16,91.77 v48.05,92.66 | v51.5,71.73 44.9,78.34 CHARGE.P$1
  Bottom(3v3GND) 0.305: v34.84,92.54 46.02,92.54 46.54,92.02 47.16,91.39
CHARGE_DONE  (via drill 0.35)
  Top(3v3+) 0.203: U$14.1/TX 58.69,59.03 57.9,59.82 57.9,63.91 v50.08,71.73
  Top(3v3+) 0.254: DONE.P$1 38.05,83.23 37,84.28 37,93.04 38.02,94.06 41.3,94.06 41.32,94.05 | 42.19,94.06 42.21,94.05
  Top(3v3+) 0.305: CHARGE_U.P$2 42.21,94.05 41.32,94.05 41.18,94.05 40.94,93.81 40.94,92.95 R22.2 40.94,92.81 40.94,89.87 41.37,89.44 R12.2
  Bottom(3v3GND) 0.203: v50.08,71.73 40.3,81.51 DONE.P$1
CHIP  (via drill 0.35)
  Top(3v3+) 0.203: 66.79,71.76 ANDS.P$3 | 66.84,71.81 ANDS.P$3 | 63.12,78.84 U$1.3 62.6,78.75 62.44,78.58 62.26,78.4 62.26,74.31 62.35,74.22 | ANDS.P$3 64.22,71.82 v64.13,71.91 | v63.24,74.05 62.53,74.05 62.35,74.22 | CHIP_LED.A 15.99,86.09 20.39,81.69 20.39,77.07 21.1,76.36 54.17,76.36 56.66,73.87 61.99,73.87 62.35,74.22
  Bottom(3v3GND) 0.203: v64.13,71.91 63.24,72.8 v63.24,74.05
CHIP_ENABLE  (via drill 0.3)
  Top(3v3+) 0.203: 19.52,86.67 CE_LED.A 24.73,86.95 25.37,86.31 26.79,86.31 27.5,85.6 v27.5,83.65 | U$14.5 56.12,56.01 56.12,62.67 47.06,71.73 v46.88,71.73 46.88,72.27 47.59,72.98 51.5,72.98 57.55,66.93 62.17,66.93 65.55,70.31 72.66,70.31 73.02,70.67 73.02,71.56 72.75,71.82 ANDS.P$6
  Bottom(3v3GND) 0.203: v46.88,71.73 37.1,81.51 29.63,81.51 v27.5,83.65
COMP_OUT  (via drill 0.3)
  Top(3v3+) 0.203: R29.2 68.39,75.19 68.39,76 68.93,76.53 68.93,80.62 69.46,81.16 69.46,84.36 69.52,84.42 U$22.G 71.36,84.42 71.59,84.18 71.59,83.11 72.66,82.05 v74.27,82.05
  Top(3v3+) 0.254: ANDS.P$5 70.43,71.17 68.52,73.08 | 68.52,73.08 66.89,73.08 ANDS.P$1 | 68.52,73.08 68.52,74.8 R29.2
  Bottom(3v3GND) 0.203: U$18.7 79.15,87.11 74.26,82.22 v74.26,82.05 v74.27,82.05
CTS
  Top(3v3+) 0.152: U$14.24 66.97,22.3 66.97,14.13 79.77,1.33 111.6,1.33 118.36,8.08 118.36,61.78 121.38,64.8 121.38,74.22 128.67,81.51 R30.1
DIR0
  Top(3v3+) 0.152: U$17.2 36.04,45.07 49.6,58.63 J1.8
DIR1
  Top(3v3+) 0.254: U$21.27 104.55,48.5 104.31,48.26 104.31,39.91 100.98,36.58 J3.4
DIR2
  Top(3v3+) 0.254: U$21.2 98.5,48.5 98.44,48.44 93.46,53.42 93.46,57.15 91.99,58.63 J4.4
DIR3
  Top(3v3+) 0.152: U$17.27 45.8,45.07 48.84,42.04 48.84,36.35 50.18,36.35 J2.8
DISCHARGE  (via drill 0.3)
  Top(3v3+) 0.203: R26.1 20.06,92.86 25.72,87.2 27.5,87.2 28.39,86.31 v28.39,85.6 | U$14.4/CANRX 57.19,57.48 57.19,63.38 49.01,71.56 48.84,71.56 v48.66,71.73
  Bottom(3v3GND) 0.203: v48.66,71.73 37.81,82.58 30.17,82.58 28.39,84.36 v28.39,85.6
DIVCAP
  Bottom(3v3GND) 0.203: R8.1 102.18,109.02 102.15,109.05
  Bottom(3v3GND) 0.254: R8.1 103.79,110.15 104.13,110.49 112.49,110.49 114.28,108.7 CAP/100.P$1
  Bottom(3v3GND) 0.305: CAP_SENSE_BUF.1 100.32,110.75 100.5,110.57 102.15,110.57 102.15,109.05 CAP_SENSE_BUF.4
DRIB  (via drill 0.3)
  Top(3v3+) 0.203: U$14.6 55.24,54.36 55.24,62.13 45.46,71.91 v45.28,71.91
  Bottom(3v3GND) 0.203: v45.28,71.91 36.57,80.62 28.74,80.62 26.43,82.94 24.1,82.94 DRIB_TEST.P$1
  Bottom(3v3GND) 0.305: DRIB_TEST.P$1 24.09,85.13 DRIB_TRAN.GATE
ENABLE0
  Top(3v3+) 0.152: U$17.4 36.52,43.77 46.35,53.6 50.18,53.6 J1.4
ENABLE1
  Top(3v3+) 0.254: J3.8 91.3,31.37 97.73,31.37 105.39,39.03 105.39,47.2 105.73,47.2 105.74,47.2 U$21.25
ENABLE2
  Top(3v3+) 0.254: U$21.4 97.52,47.2 J4.8
ENABLE3
  Top(3v3+) 0.152: U$17.25 44.97,43.77 47.59,41.15 47.59,31.37 47.64,31.32 J2.4
FAULT0
  Top(3v3+) 0.152: U$17.5 36.76,43.12 44.75,51.11 50.13,51.11 J1.2
FAULT1
  Top(3v3+) 0.254: U$21.24 107.78,46.49 105.91,46.49 105.91,38.48 95.95,28.53 91.61,28.53 J3.10
FAULT2
  Top(3v3+) 0.254: U$21.5 95.63,46.55 J4.10
FAULT3
  Top(3v3+) 0.152: U$17.24 44.55,43.12 46.88,40.8 46.88,28.88 46.98,28.78 J2.2
GND  (via drill 0.3, 0.35, 0.5, 1)  (8 unrouted)
  Top(3v3+) 0.203: U$22.S 70.53,82.43 70.53,81.34 v71.42,80.45 71.42,80.27 | R4.2 16.6,80.87 R9.1 16.57,81.59 v13.63,84.53 | 18.58,94.01 18.58,94.89 v19.05,95.35 | R11.2 31.94,89.55 v31.94,90.94 | 19.22,99.85 19.24,99.83 v20.92,99.83 | U$17.10 33.33,39.87 32.66,39.2 31.48,39.2 C35.2 | C35.2 29.35,39.21 C36.2 | C35.2 31.46,38 31.41,37.95 v31.41,37.77 | U$17.17 U$17.16 U$17.15 41.73,36.19 41.72,36.17 v41.72,35.82 | ANDS.P$4 64.98,71.17 v64.48,70.67
  Top(3v3+) 0.254: C15.2 70.99,69.1 v71.21,69.12 | U$5.2 19.22,99.85 | U$21.10 97.89,43.3 96.49,44.71 v96.49,44.89 | U$21.16 U$21.15 107.85,39.74 107.86,39.73 v107.86,39.55 | C38.2 112.33,43.8 C37.2 113.42,43.78 113.55,43.64 v113.55,42.93
  Top(3v3+) 0.305: R10.1 18.44,93.87 R5.2 18.58,94.01 | BB_CON.5 46.07,8.09 47.13,9.15 50.08,9.15 50.13,9.1 C12.2 50.13,5.51 BB_CON.3 | GND.P$1 108.91,7.88 108.93,7.9 v108.93,8.26 | C10.1 122.27,92.71 121.38,91.83 v121.38,92
  Top(3v3+) 0.61: U$19.2 69.82,13.51 v69.82,15.02
  Top(3v3+) 1.016: C9.2 99.71,7.96 C8.2 99.7,9.7 C11.2 | C11.2 | C11.2 100.11,11.71 v100.4,11.99
  Top(3v3+) 2.54: 3.3REG1.DRAIN 82.65,7.87 82.62,7.9 v82.44,7.9
  Bottom(3v3GND) 0.203: 63.03,60.23 62.83,60.48 62.63,60.28 | 56.84,77.19 56.94,77.3 | v71.42,80.45 71.42,80.09
  Bottom(3v3GND) 0.254: v71.21,69.12 71.01,69.17 71.16,69.32
  pour Bottom(3v3GND): 66.08,-10.59 117.47,-10.59 146.09,18.04 146.09,109.07 111.42,143.74 33.01,143.74 -5.04,105.69 -5.04,20.53 25.72,-10.23 65.73,-10.23
INT1  (via drill 0.35)
  Top(3v3+) 0.203: U$17.20 43.41,40.52 v44.39,41.51
  Bottom(3v3GND) 0.203: v44.39,41.51 60.47,41.51 U$14.9/CS
INT2
  Top(3v3+) 0.254: U$14.39/A20 79.52,21.95 95.95,21.95 106.44,32.44 106.44,43.64 106.75,43.95 U$21.20
KICK  (via drill 0.35, 0.5)
  Top(3v3+) 0.203: v72.18,79.12 72.48,79.12 72.84,78.77 73.36,78.77 U$4.3 | KICK_LED.A 16.23,75.22 16.48,75.47 v53.81,75.47
  Top(3v3+) 0.254: U$4.3 73.37,77.88 72.58,77.09 72.58,75.06 72.84,74.81 72.84,72.62 72.69,72.47 ANDS.P$7
  Bottom(3v3GND) 0.203: 69.94,79.12 69.99,79.12 | 69.99,79.12 v72.18,79.12 | 53.64,75.47 v53.81,75.47 66.34,75.47 69.99,79.12
KICK_ENABLE
  Top(3v3+) 0.203: ANDS.P$2 64.81,72.47 63.95,73.33 62.7,73.33 62.53,73.51 53.64,73.51 52.39,74.76 41.37,74.76 | 41.37,74.76 21.63,74.76 20.88,74.01 KE_LED.A | U$14.7 59.5,47.55 59.5,49.15 54.35,54.31 54.35,61.78 41.37,74.76
KICK_REF  (via drill 0.35)
  Top(3v3+) 0.203: U$14.A22/DAC1 89.35,26.01 89.91,26.57 89.91,40.44 90.08,40.62 98.26,40.62 98.97,39.91 101.82,39.91 102.17,40.26 102.17,49.15 102.17,50.04 v102.17,72.8
  Bottom(3v3GND) 0.203: R37.1 102.17,79.34 v102.17,72.8 102.17,72.45
LOCKN0
  Top(3v3+) 0.152: U$17.1 35.8,45.72 48.48,58.4 48.48,61.06 48.58,61.17 J1.10
LOCKN1
  Top(3v3+) 0.254: U$21.28 103.95,49.15 103.6,48.8 103.6,40.09 102.71,39.2 91.25,39.2 J3.2
LOCKN2
  Top(3v3+) 0.254: U$21.1 98.8,49.15 94.17,53.78 94.17,58.75 91.76,61.17 J4.2
LOCKN3
  Top(3v3+) 0.152: U$17.28 46.04,45.72 50.26,41.51 50.26,38.97 J2.10
LOWCHIP
  Bottom(3v3GND) 0.813: CHIP.2 4.51,87.82 | 10.19,84.92 CHIP_FLY.ANODE | 17.59,90.5 KICK_Q1.DRAIN
  Bottom(3v3GND) 1.27: 4.51,87.82 7.41,84.92 10.19,84.92 | CHIP_FLY.ANODE 10.3,86.79 14.01,90.5 17.59,90.5
LOWKICK
  Bottom(3v3GND) 0.813: 17.12,76.28 KICK_Q.DRAIN
  Bottom(3v3GND) 1.27: KICK.2 7,72.28 KICK_FLY.ANODE 10.3,73.84 12.74,76.28 17.12,76.28
M1QA-1
  Bottom(3v3GND) 0.203: J5.2 56.81,19.66 R58.2
M1QA-1OUT
  Bottom(3v3GND) 0.203: R58.1 60.23,18.09 R59.1 60.53,18.39 U$14.27
M1QA-2
  Bottom(3v3GND) 0.203: J6.2 91.1,23.07 86,28.17 86,42.04 85.11,42.93 83.16,42.93 R52.2
M1QA-2OUT
  Bottom(3v3GND) 0.203: R52.1 81.34,42.95 R53.1 81.11,41.25 U$14.17/A3
M1QA-3
  Bottom(3v3GND) 0.203: J7.2 90.8,14.61 90.8,17.86 90.44,18.22 84.93,18.22 84.04,19.11 84.04,32.62 83.63,33.02 R54.2
M1QA-3OUT
  Bottom(3v3GND) 0.203: R54.1 81.36,34.95 R55.1 80.19,36.17 U$14.15/A1
M1QA-4  (via drill 0.35)
  Top(3v3+) 0.203: J8.2 51.45,22.79 v56.66,28
  Bottom(3v3GND) 0.203: v56.66,28 58.45,28 R56.2
M1QA-4OUT
  Bottom(3v3GND) 0.203: R56.1 60.25,28 R57.1 61.52,24.62 63.24,24.62 63.26,24.59 U$14.25
M1QB-1  (via drill 0.3)
  Top(3v3+) 0.203: J5.4 46.37,13.21 47.77,11.82 58.26,11.82 58.44,11.99 v58.44,12.53
  Bottom(3v3GND) 0.203: v58.44,12.53 58.44,14.21 R50.2
M1QB-1OUT
  Bottom(3v3GND) 0.203: R50.1 60.23,14.25 R51.1 63.11,16.01 U$14.28
M1QB-2
  Bottom(3v3GND) 0.203: J6.4 84.75,21.26 84.75,36.53 84.24,37.04 R44.2
M1QB-2OUT
  Bottom(3v3GND) 0.203: R44.1 81.31,38.97 R45.1 78.78,38.99 U$14.16/A2
M1QB-3
  Bottom(3v3GND) 0.203: J7.4 83.11,17.21 R46.2
M1QB-3OUT
  Bottom(3v3GND) 0.203: R46.1 81.34,29.19 R47.1 81.26,31.2 80.31,31.2 79.95,31.55 79.95,33.51 79.82,33.63 U$14.14/A0
M1QB-4
  Bottom(3v3GND) 0.203: J8.4 46.37,22.51 47.77,23.91 58.3,23.91 R48.2
M1QB-4OUT
  Bottom(3v3GND) 0.203: R48.1 60.33,21.87 R49.1 61.1,21.77 61.99,20.88 63.21,20.88 U$14.26
N$1
  Top(3v3+) 0.152: DRAIN.P$1 58.96,83.11 58.97,83.11
  Top(3v3+) 0.61: 60.37,83.11 SWITCH_Q.DRAIN
  pour Top(3v3+): 58.59,89.36 75.73,89.36 86.66,78.31 86.66,73.99 86.4,73.74 80.43,73.74 79.92,74.25 79.92,81.49 74.34,86.82 68.62,86.82 67.61,85.81 67.61,81.61 58.59,81.61
N$2  (via drill 0.35)
  Top(3v3+) 0.152: v46.7,68 40.48,74.22 27.68,74.22 27.5,74.05 v27.5,73.87
  Top(3v3+) 0.203: U$4.5 75.27,74.81 v75.33,74.76
  Bottom(3v3GND) 0.152: v75.33,74.76 75.33,69.6 73.73,68 v46.7,68 | v27.5,73.87 26.86,73.87 25.72,75.01 25.13,75.01
  Bottom(3v3GND) 0.203: 25.13,75.01 R1.1
N$3
  Bottom(3v3GND) 0.305: R2.2 23.1,92.57 KICK_Q1.GATE
N$4
  Top(3v3+) 0.152: R28.2 137.8,89.69 U$15.16
N$5  (via drill 0.35)
  Top(3v3+) 0.203: v60.93,78.67 59.15,78.67 57.73,77.25 31.05,77.25 29.28,79.02 29.28,87.56 v26.08,90.76 | U$1.5 64.13,77.14 | 64.13,77.14 64.13,77.25 | 64.13,77.14 v64.13,77.07
  Bottom(3v3GND) 0.203: R2.1 25.72,91.11 v26.08,90.76 | v64.13,77.07 62.53,78.67 v60.93,78.67 60.75,78.67
N$6
  Top(3v3+) 0.254: CHARGE_U.P$8 58.2,93.55 58.97,94.31 68.22,94.31 71.24,91.29 71.24,90.35 R31.1 71.09,90.5
N$7
  Top(3v3+) 0.305: C19.1 56.19,96.33 RBG.2 56.2,95.56 56.3,95.46 56.56,95.46 56.68,95.33 56.68,94.58 CHARGE_U.P$10
N$8
  Bottom(3v3GND) 0.305: R1.2 23.28,76.56 KICK_Q.GATE
N$9  (via drill 0.5)
  Top(3v3+) 0.254: SWITCH_Q.GATE 67.31,91.61 v67.35,91.65
  Top(3v3+) 0.305: R43.2 64.69,90.87 SWITCH_Q.GATE
  Bottom(3v3GND) 0.254: v67.35,91.65 67.35,96.09 65.19,98.25 63.29,98.25 GATE.P$1
N$10
  Top(3v3+) 0.254: U$6.RIGHT 28.42,119.96 20.44,119.96 17.64,117.16 17.64,116.1
  Top(3v3+) 0.305: R3.1 19.44,114.31 17.64,116.1 | 28.53,120.01 U$6.RIGHT
  Top(3v3+) 0.406: U$6.RIGHT 28.73,119.48 33.06,115.14 33.06,112.94 U$2.LOWER_RIGHT
N$11
  Top(3v3+) 0.203: 19.3,78.06 KE_LED.C
  Top(3v3+) 0.305: R4.1 19.05,78.3 19.3,78.06
N$12
  Top(3v3+) 0.254: CHARGE_U.P$9 57.81,94.05 58.72,94.95 70.6,94.95 73.91,91.65 73.91,90.41 RVOUT.1
N$13
  Top(3v3+) 0.305: R5.1 18.47,91.58 19,91.05 19.23,91.05 19.26,91.03 19.26,89.97 CE_LED.C
N$14
  Top(3v3+) 0.254: R6.1 68.22,80.11 68.22,80.8 68.93,81.51 68.93,85.25 69.11,85.42 72.13,85.42 73.02,84.71 U$22.D
N$15
  Top(3v3+) 0.305: R9.2 16.57,78.33 16.14,77.89 16.14,77.06 KICK_LED.C
N$16
  Top(3v3+) 0.152: R30.2 137.8,81.51 U$15.12
N$17
  Top(3v3+) 0.305: R10.2 16.53,91.57 15.95,91 15.95,89.97 CHIP_LED.C
N$18
  Top(3v3+) 0.254: 16.82,115.92 16.82,117.05 20.38,120.6 22.53,120.6 23.21,121.19
  Top(3v3+) 0.305: R16.2 9.4,102.6 R13.1 11.36,102.57 19.85,102.57 20.17,102.89 20.17,110.19 19.44,110.92 R3.2 18.8,111.5 18.22,112.08 18.22,114.52 16.82,115.92 | 23.21,121.19 26.14,124.11 29.17,124.11 31.03,122.25 31.03,120.05 U$6.CENTER
N$19
  Top(3v3+) 0.305: DONE_LED.C 39.87,87.15 40.43,87.71 41.71,87.71 R12.1
N$20
  Top(3v3+) 0.305: R11.1 32.79,87.73 33.19,87.33 34.6,87.33 CHARGE_LED.C
N$21
  Top(3v3+) 0.305: R25.1 33.44,107.48 U$2.LOWER_LEFT
N$23
  Top(3v3+) 0.254: R21.2 122.42,112.9 122.72,112.6 122.72,110.76 PW_LED1.C
N$24
  Top(3v3+) 0.254: 56.71,91.11 56.81,91.01
  Top(3v3+) 0.305: 56.71,91.11 CHARGE_U.P$6
  Top(3v3+) 1.93: RSENSE.2 55.19,89.9 56.3,91.01 56.81,91.01 60.23,91.01 SWITCH_Q.SOURCE
N$25  (1 unrouted)
N$26  (1 unrouted)
N$29
  Top(3v3+) 0.254: U$5.4 14.79,103.59 8.47,103.55 8.47,104.4
  Top(3v3+) 0.305: R23.2 8.47,104.4 9.4,104.4 R16.1
N$30
  Top(3v3+) 0.305: U$5.1 16.21,99.86 15.92,99.52 15.92,98.25 16.43,97.74 17.45,97.74 R26.2
N$32
  Top(3v3+) 0.305: BB_CON.4 48.07,8.27 R19.2
N$33
  Top(3v3+) 0.254: R6.2 69.95,79.91 70.7,79.91 70.68,79.89 KICK_READY.C
N$34
  Top(3v3+) 0.305: CHARGE_U.P$7 58.72,93.05 59.48,93.81 62.91,93.81 63.16,93.55 R43.1
N$35  (via drill 0.35)
  Bottom(3v3GND) 0.203: R8.2 105.71,108.89 v106.8,108.89 111.06,104.63 111.06,93.96 104.22,87.11 U$18.2
N$36  (via drill 0.7)
  Top(3v3+) 1.016: v25.39,115.85 25.39,111.14 U$2.TAB
  Bottom(3v3GND) 1.016: U$7.- 33.7,127.89 35.75,125.2 35.91,125.2 37.84,123.27 37.94,123.27 40.33,120.88 40.33,118.14 38.55,116.36 25.9,116.36 v25.39,115.85
N$38
  Bottom(3v3GND) 0.2: C13.2 70.87,41.85 U$8.8 U$8.7 72.2,39.65 72.48,39.37 72.48,38.84 72.66,38.66 R32.1
N$40
  Top(3v3+) 0.203: R20.2 54.05,5.47 BB_CON.1
N$65
  Bottom(3v3GND) 0.203: U$18.3 97.17,85.84 R37.2
PWM0
  Top(3v3+) 0.203: U$14.10/CS 54.35,45.09 54.35,53.06 53.86,53.55 J1.3
PWM1
  Top(3v3+) 0.152: 77.03,32.39 64.65,44.77
  Top(3v3+) 0.203: U$14.2 63.26,56.04 64.65,54.65 64.65,44.77 | 77.03,32.39 77.28,32.39 79.29,32.39 80.18,31.5 J3.7
PWM2
  Top(3v3+) 0.203: U$14.3/CANTX 61.81,55.4 61.81,57.69 64.13,57.69 65.37,56.44 73.73,56.44 74.86,55.31 85.7,55.31 87.6,53.42 88.51,53.42 J4.7
PWM3
  Top(3v3+) 0.203: U$14.29 61.1,15.47 61.1,26.39 56.18,31.32 J2.3
RTS
  Top(3v3+) 0.152: U$14.35/A16 76.75,9.02 76.75,4.88 79.95,1.68 111.42,1.68 117.82,8.08 117.82,61.95 120.84,64.98 120.84,82.94 127.6,89.69 R28.1
  Top(3v3+) 0.203: 132.94,89.68 R28.1
RX
  Top(3v3+) 0.152: U$14.34/A15 77.28,7.01 77.28,5.06 80.31,2.04 111.24,2.04 117.29,8.08 117.29,62.49 120.13,65.33 120.13,68.89 118.18,70.84 118.18,93.31 U$15.2
SCL
  Bottom(3v3GND) 0.2: U$8.3 73.47,48.7 73.2,48.96 R27.1
  Bottom(3v3GND) 0.203: U$8.3 73.47,45.49 73.73,45.24 77.28,45.24 78.38,46.33 U$14.19/A5/SCL
SCL-H  (via drill 0.35)
  Top(3v3+) 0.152: v38.17,38.48 34.62,38.48 U$17.12
  Top(3v3+) 0.203: U$21.12 95.28,42 94.71,42.57 78,42.57 76.39,44.17 v73.55,44.17
  Bottom(3v3GND) 0.152: R33.1 72.66,36.88 72.48,36.71 72.48,34.22 70.7,32.44 58.97,32.44 53.1,26.57 47.06,26.57 38.34,35.28 38.34,38.48 v38.17,38.48
  Bottom(3v3GND) 0.2: R33.1 73.56,37.06 74.26,37.06 74.44,37.24 74.44,39.55 73.47,40.52 73.47,41.69 U$8.6
  Bottom(3v3GND) 0.203: v73.55,44.17 73.47,44.1 73.47,41.69
SDA
  Top(3v3+) 0.254: 78.53,43.82 U$14.18/A4/SDA
  Bottom(3v3GND) 0.2: U$8.4 74.74,52.23 74.26,52.71 R7.1
  Bottom(3v3GND) 0.203: U$8.4 75.15,47.55 79.59,47.55 80.31,46.84 80.31,44.53 79.57,43.79 U$14.18/A4/SDA
SDA-H  (via drill 0.35)
  Top(3v3+) 0.152: v37.28,37.24 36.57,37.95 34.56,37.95 U$17.13
  Top(3v3+) 0.203: U$21.13 83.35,41.35 82.08,40.09 v76.57,40.09
  Bottom(3v3GND) 0.152: R34.1 73.38,33.87 71.06,31.55 65.55,31.55 63.95,29.95 57.55,29.95 53.46,25.86 46.35,25.86 37.28,34.93 v37.28,37.24
  Bottom(3v3GND) 0.2: R34.1 74.26,35.11 74.79,35.64
  Bottom(3v3GND) 0.203: 74.79,35.64 74.79,39.91 | 74.79,39.91 74.79,41.86 U$8.5 | 74.79,39.91 76.39,39.91 v76.57,40.09
TO_DRIB
  Bottom(3v3GND) 0.813: 6.13,81.76 6.7,82.33 | 17.67,82.33 DRIB_TRAN.DRAIN
  Bottom(3v3GND) 1.27: DRIB.2 6.13,81.76 | 6.7,82.33 17.67,82.33
TO_NEON
  Bottom(3v3GND) 0.254: 74.34,99.66 NEON.1
  Bottom(3v3GND) 0.61: 74.34,99.66 R24.1
TRANS_OUT  (via drill 1.3 pad 2.79)
  Top(3v3+) 2.184: v91.99,108.03 91.99,106.76 96.56,102.19 96.56,97.87 96.44,97.74 96.44,98.37 U$3.P$1
  Bottom(3v3GND) 2.184: CHARGE_D.A 91.88,108.14 v91.99,108.03
TX
  Top(3v3+) 0.152: U$15.3 116.4,93.6 117.47,92.54 117.47,73.87 117.47,73.69 117.47,70.49 119.6,68.36 119.6,65.69 116.75,62.84 116.75,8.26 111.06,2.57 81.63,2.57 U$14.33/A14
UNBUF_DIVCAP
  Bottom(3v3GND) 0.305: CLAMP2.C 99.88,118.85 R15.2 102.98,121.7 R14.1 103.01,120.76 103.42,120.35 103.42,118.84 CLAMP1.A 104.71,118.81 105.33,118.19 105.33,112.22 104.69,111.59 CAP_SENSE_BUF.3

## Text on the board
Dimension: Dimensions in mm
Document: MOTHERBOARD